# Altium project MR26_GSS.PrjPcb (part 1 of 2)
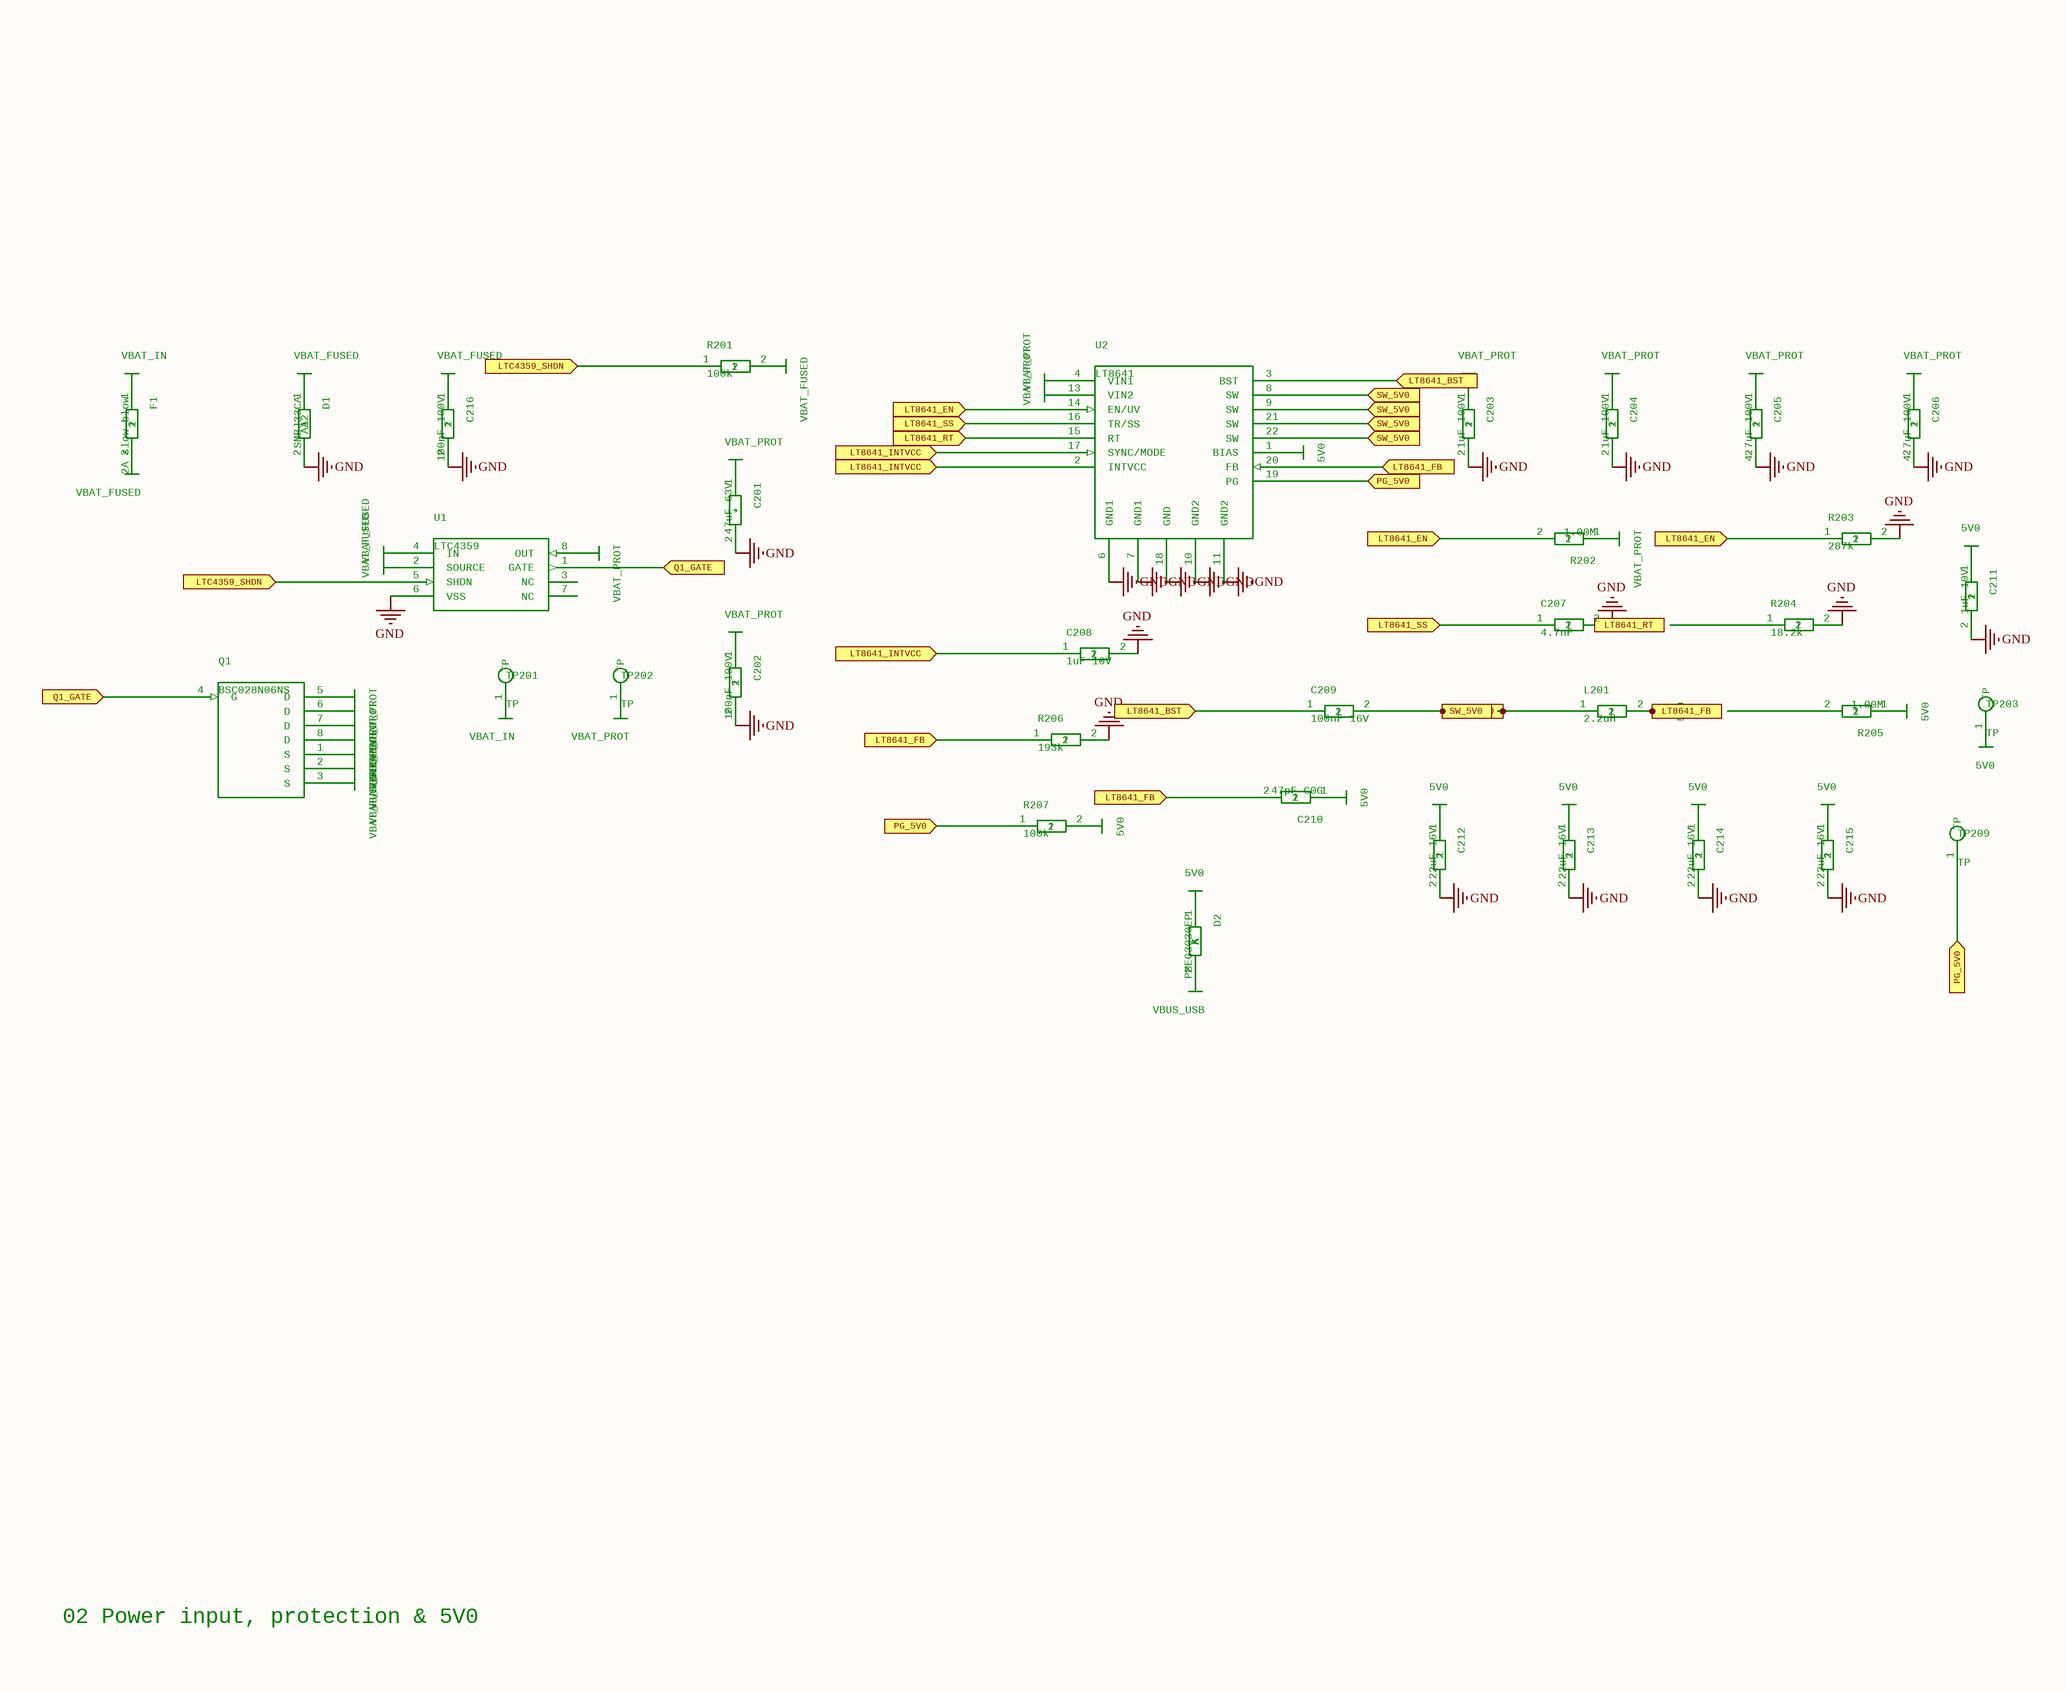
[diagram p0: MR26_GSS_0.SchDoc]
9 sheets, 655 parts. Net scope: global (net labels, ports and power ports of the same name join across sheets).
Board file: MR26_GSS.PcbDoc
Sheets:
  MR26_GSS_0.SchDoc
  MR26_GSS_1.SchDoc
  MR26_GSS_2.SchDoc
  MR26_GSS_3.SchDoc
  MR26_GSS_4.SchDoc
  MR26_GSS_5.SchDoc
  MR26_GSS_6.SchDoc
  MR26_GSS_7.SchDoc
  MR26_GSS_8.SchDoc

## Sheet MR26_GSS_0.SchDoc
size 363 x 297 mm; Origin: Eagle; OriginPath: C:\Users\David Nguyen\Downloads\eagle\eagle\MR26_GSS.sch; OriginSheet: 1; OriginDescription: 02 Power input, protection & 5V0

### Parts
C201  47uF 63V  [C_CP_Elec_8x10]
C202  100nF 100V  [C_0603]
C203  1uF 100V  [C_0805]
C204  1uF 100V  [C_0805]
C205  4.7uF 100V  [C_1210]
C206  4.7uF 100V  [C_1210]
C207  4.7nF  [C_0402]
C208  1uF 10V  [C_0402]
C209  100nF 16V  [C_0402]
C210  47pF C0G  [C_0402]
C211  1uF 10V  [C_0402]
C212  22uF 16V  [C_1210]
C213  22uF 16V  [C_1210]
C214  22uF 16V  [C_1210]
C215  22uF 16V  [C_1210]
C216  100nF 100V  [C_0603]
D1  SMBJ33CA  [D_SMB]
D2  PMEG3030EP  [D_SOD-128]
F1  2A slow-blow  [Fuse_Nano2_452]
L201  2.2uH  [L_XEL4030]
PWR0001  VBAT_IN
PWR0002  VBAT_FUSED
PWR0003  VBAT_FUSED
PWR0005  VBAT_FUSED
PWR0007  VBAT_FUSED
PWR0008  VBAT_FUSED
PWR0010  VBAT_PROT
PWR0011  VBAT_FUSED
PWR0012  VBAT_PROT
PWR0013  VBAT_PROT
PWR0014  VBAT_PROT
PWR0015  VBAT_PROT
PWR0016  VBAT_FUSED
PWR0017  VBAT_FUSED
PWR0018  VBAT_FUSED
PWR0019  VBAT_PROT
PWR0021  VBAT_PROT
PWR0023  VBAT_IN
PWR0024  VBAT_PROT
PWR0025  VBAT_PROT
PWR0026  VBAT_PROT
PWR0027  5V0
PWR0033  VBAT_PROT
PWR0035  VBAT_PROT
PWR0037  VBAT_PROT
PWR0039  VBAT_PROT
PWR0041  VBAT_PROT
PWR0046  5V0
PWR0047  5V0
PWR0049  5V0
PWR0050  5V0
PWR0052  5V0
PWR0054  5V0
PWR0056  5V0
PWR0058  5V0
PWR0060  5V0
PWR0061  5V0
PWR0062  VBUS_USB
PWR0063  5V0
Q1  BSC028N06NS  [PG-TDSON-8]
R201  100k  [R_0402]
R202  1.00M  [R_0402]
R203  287k  [R_0402]
R204  18.2k  [R_0402]
R205  1.00M  [R_0402]
R206  193k  [R_0402]
R207  100k  [R_0402]
TP201  TP  [TP_1.0mm]
TP202  TP  [TP_1.0mm]
TP203  TP  [TP_1.0mm]
TP209  TP  [TP_1.0mm]
U1  LTC4359  [MSOP-8]
U2  LT8641  [QFN-18_3x4_UDC]

### Ports
LT8641_BST (in), LT8641_EN (in), LT8641_FB (in), LT8641_INTVCC (in), LT8641_RT (in), LT8641_SS (in), LTC4359_SHDN (in), PG_5V0 (in), Q1_GATE (in), SW_5V0 (in)

### Nets
GND: C201.2(-) C202.2 C203.2 C204.2 C205.2 C206.2 C207.2 C208.2 C211.2 C212.2 C213.2 C214.2 C215.2 C216.2 D1.2(A2) R203.2 R204.2 R206.2 U1.6(VSS) U2.6(GND1) U2.7(GND1) U2.10(GND2) U2.11(GND2) U2.18(GND)
NetC201_1: C201.1(+) PWR0019.?1(VBAT_PROT)
NetC202_1: C202.1 PWR0021.?1(VBAT_PROT)
NetC203_1: C203.1 PWR0033.?1(VBAT_PROT)
NetC204_1: C204.1 PWR0035.?1(VBAT_PROT)
NetC205_1: C205.1 PWR0037.?1(VBAT_PROT)
NetC206_1: C206.1 PWR0039.?1(VBAT_PROT)
NetC207_1: C207.1 U2.16(TR/SS) ; port LT8641_SS
NetC208_1: C208.1 U2.2(INTVCC) U2.17(SYNC/MODE) ; port LT8641_INTVCC
NetC209_1: C209.1 U2.3(BST) ; port LT8641_BST
NetC209_2: C209.2 L201.1 U2.8(SW) U2.9(SW) U2.21(SW) U2.22(SW) ; port SW_5V0
NetC210_1: C210.1 PWR0049.?1(5V0)
NetC210_2: C210.2 L201.2 PWR0046.?1(5V0) R206.1 U2.20(FB) ; port LT8641_FB
NetC211_1: C211.1 PWR0050.?1(5V0)
NetC212_1: C212.1 PWR0052.?1(5V0)
NetC213_1: C213.1 PWR0054.?1(5V0)
NetC214_1: C214.1 PWR0056.?1(5V0)
NetC215_1: C215.1 PWR0058.?1(5V0)
NetC216_1: C216.1 PWR0005.?1(VBAT_FUSED)
NetD1_1: D1.1(A1) PWR0003.?1(VBAT_FUSED)
NetD2_1: D2.1(K) PWR0061.?1(5V0)
NetD2_2: D2.2(A) PWR0062.?1(VBUS_USB)
NetF1_1: F1.1 PWR0001.?1(VBAT_IN)
NetF1_2: F1.2 PWR0002.?1(VBAT_FUSED)
NetPWR0007_?1: PWR0007.?1(VBAT_FUSED) U1.4(IN)
NetPWR0008_?1: PWR0008.?1(VBAT_FUSED) U1.2(SOURCE)
NetPWR0010_?1: PWR0010.?1(VBAT_PROT) U1.8(OUT)
NetPWR0011_?1: PWR0011.?1(VBAT_FUSED) R201.2
NetPWR0012_?1: PWR0012.?1(VBAT_PROT) Q1.5(D)
NetPWR0013_?1: PWR0013.?1(VBAT_PROT) Q1.6(D)
NetPWR0014_?1: PWR0014.?1(VBAT_PROT) Q1.7(D)
NetPWR0015_?1: PWR0015.?1(VBAT_PROT) Q1.8(D)
NetPWR0016_?1: PWR0016.?1(VBAT_FUSED) Q1.1(S)
NetPWR0017_?1: PWR0017.?1(VBAT_FUSED) Q1.2(S)
NetPWR0018_?1: PWR0018.?1(VBAT_FUSED) Q1.3(S)
NetPWR0023_?1: PWR0023.?1(VBAT_IN) TP201.1(TP)
NetPWR0024_?1: PWR0024.?1(VBAT_PROT) TP202.1(TP)
NetPWR0025_?1: PWR0025.?1(VBAT_PROT) U2.4(VIN1)
NetPWR0026_?1: PWR0026.?1(VBAT_PROT) U2.13(VIN2)
NetPWR0027_?1: PWR0027.?1(5V0) U2.1(BIAS)
NetPWR0041_?1: PWR0041.?1(VBAT_PROT) R202.1
NetPWR0047_?1: PWR0047.?1(5V0) R205.1
NetPWR0060_?1: PWR0060.?1(5V0) R207.2
NetPWR0063_?1: PWR0063.?1(5V0) TP203.1(TP)
NetQ1_4: Q1.4(G) U1.1(GATE) ; port Q1_GATE
NetR201_1: R201.1 U1.5(SHDN) ; port LTC4359_SHDN
NetR202_2: R202.2 R203.1 U2.14(EN/UV) ; port LT8641_EN
NetR207_1: R207.1 TP209.1(TP) U2.19(PG) ; port PG_5V0
NetU2_15: U2.15(RT) ; port LT8641_RT

Not connected (* = marked no-connect by the designer): R204 1; R205 2; U1 3(NC) 7(NC)

### Notes on the sheet
- 02 Power input, protection & 5V0

### Library data of the parts
C201 = CAP_POLC_CP_Elec_8x10: MPN: Panasonic EEH-ZC1J470P; GateName_1: G$1; SymbolName_1: CAP_POL; DeviceName: C_CP_Elec_8x10; LibraryName: MR26; DeviceSetName: CAP_POL
C202 C216 = CAPC_0603: MPN: CAP 100nF 100V 0603; GateName_1: G$1; SymbolName_1: CAP; DeviceName: C_0603; LibraryName: MR26; DeviceSetName: CAP
C203 C204 = CAPC_0805: MPN: CAP 1uF 100V 0805; GateName_1: G$1; SymbolName_1: CAP; DeviceName: C_0805; LibraryName: MR26; DeviceSetName: CAP
C205 C206 = CAPC_1210: MPN: CAP 4.7uF 100V 1210; GateName_1: G$1; SymbolName_1: CAP; DeviceName: C_1210; LibraryName: MR26; DeviceSetName: CAP
C207 = CAPC_0402: MPN: CAP 4.7nF 0402; GateName_1: G$1; SymbolName_1: CAP; DeviceName: C_0402; LibraryName: MR26; DeviceSetName: CAP
C208 C211 = CAPC_0402: MPN: CAP 1uF 10V 0402; GateName_1: G$1; SymbolName_1: CAP; DeviceName: C_0402; LibraryName: MR26; DeviceSetName: CAP
C209 = CAPC_0402: MPN: CAP 100nF 16V 0402; GateName_1: G$1; SymbolName_1: CAP; DeviceName: C_0402; LibraryName: MR26; DeviceSetName: CAP
C210 = CAPC_0402: MPN: CAP 47pF C0G 0402; GateName_1: G$1; SymbolName_1: CAP; DeviceName: C_0402; LibraryName: MR26; DeviceSetName: CAP
C212-C215 = CAPC_1210: MPN: CAP 22uF 16V 1210; GateName_1: G$1; SymbolName_1: CAP; DeviceName: C_1210; LibraryName: MR26; DeviceSetName: CAP
D1 = TVS_BIDIRD_SMB: GateName_1: G$1; SymbolName_1: TVS_BIDIR; DeviceName: D_SMB; LibraryName: MR26; DeviceSetName: TVS_BIDIR; MPN: SMBJ33CA
D2 = DIODE_SCHOTTKYD_SOD-128: GateName_1: G$1; SymbolName_1: DIODE_SCHOTTKY; DeviceName: D_SOD-128; LibraryName: MR26; DeviceSetName: DIODE_SCHOTTKY; MPN: PMEG3030EP
F1 = FUSEFuse_Nano2_452: MPN: Littelfuse 0452002.MRL; GateName_1: G$1; SymbolName_1: FUSE; DeviceName: Fuse_Nano2_452; LibraryName: MR26; DeviceSetName: FUSE
L201 = INDL_XEL4030: MPN: Coilcraft XEL4030-222MEC; GateName_1: G$1; SymbolName_1: IND; DeviceName: L_XEL4030; LibraryName: MR26; DeviceSetName: IND
PWR0001 PWR0023 = PWR_VBAT_IN: GateName_1: G$1; SymbolName_1: PWR_VBAT_IN; LibraryName: MR26; DeviceSetName: PWR_VBAT_IN
PWR0002 PWR0003 PWR0005 PWR0007 PWR0008 PWR0011 PWR0016 PWR0017 PWR0018 = PWR_VBAT_FUSED: GateName_1: G$1; SymbolName_1: PWR_VBAT_FUSED; LibraryName: MR26; DeviceSetName: PWR_VBAT_FUSED
PWR0010 PWR0012 PWR0013 PWR0014 PWR0015 PWR0019 PWR0021 PWR0024 PWR0025 PWR0026 PWR0033 PWR0035 PWR0037 PWR0039 PWR0041 = PWR_VBAT_PROT: GateName_1: G$1; SymbolName_1: PWR_VBAT_PROT; LibraryName: MR26; DeviceSetName: PWR_VBAT_PROT
PWR0027 PWR0046 PWR0047 PWR0049 PWR0050 PWR0052 PWR0054 PWR0056 PWR0058 PWR0060 PWR0061 PWR0063 = PWR_5V0: GateName_1: G$1; SymbolName_1: PWR_5V0; LibraryName: MR26; DeviceSetName: PWR_5V0
PWR0062 = PWR_VBUS_USB: GateName_1: G$1; SymbolName_1: PWR_VBUS_USB; LibraryName: MR26; DeviceSetName: PWR_VBUS_USB
Q1 = NMOS_SUPERSO8PG-TDSON-8: GateName_1: G$1; SymbolName_1: NMOS_SUPERSO8; DeviceName: PG-TDSON-8; LibraryName: MR26; DeviceSetName: NMOS_SUPERSO8; MPN: BSC028N06NS
R201 R207 = RESR_0402: MPN: RES 100k 0402; GateName_1: G$1; SymbolName_1: RES; DeviceName: R_0402; LibraryName: MR26; DeviceSetName: RES
R202 R205 = RESR_0402: MPN: RES 1.00M 0402; GateName_1: G$1; SymbolName_1: RES; DeviceName: R_0402; LibraryName: MR26; DeviceSetName: RES
R203 = RESR_0402: MPN: RES 287k 0402; GateName_1: G$1; SymbolName_1: RES; DeviceName: R_0402; LibraryName: MR26; DeviceSetName: RES
R204 = RESR_0402: MPN: RES 18.2k 0402; GateName_1: G$1; SymbolName_1: RES; DeviceName: R_0402; LibraryName: MR26; DeviceSetName: RES
R206 = RESR_0402: MPN: RES 193k 0402; GateName_1: G$1; SymbolName_1: RES; DeviceName: R_0402; LibraryName: MR26; DeviceSetName: RES
TP201-TP203 TP209 = TESTPOINTTP_1.0mm: MPN: Keystone 5019 / 1.0 mm pad; GateName_1: G$1; SymbolName_1: TESTPOINT; DeviceName: TP_1.0mm; LibraryName: MR26; DeviceSetName: TESTPOINT
U1 = LTC4359_MS8MSOP-8: MPN: LTC4359HMS8#PBF; GateName_1: G$1; SymbolName_1: LTC4359_MS8; DeviceName: MSOP-8; LibraryName: MR26; DeviceSetName: LTC4359_MS8
U2 = LT8641_QFN18QFN-18_3x4_UDC: MPN: LT8641EUDC#PBF; GateName_1: G$1; SymbolName_1: LT8641_QFN18; DeviceName: QFN-18_3x4_UDC; LibraryName: MR26; DeviceSetName: LT8641_QFN18

## Sheet MR26_GSS_1.SchDoc
size 337 x 296 mm; Origin: Eagle; OriginPath: C:\Users\David Nguyen\Downloads\eagle\eagle\MR26_GSS.sch; OriginSheet: 2; OriginDescription: 03 Point-of-load regulators 1V1 / 2V5 / 3V3
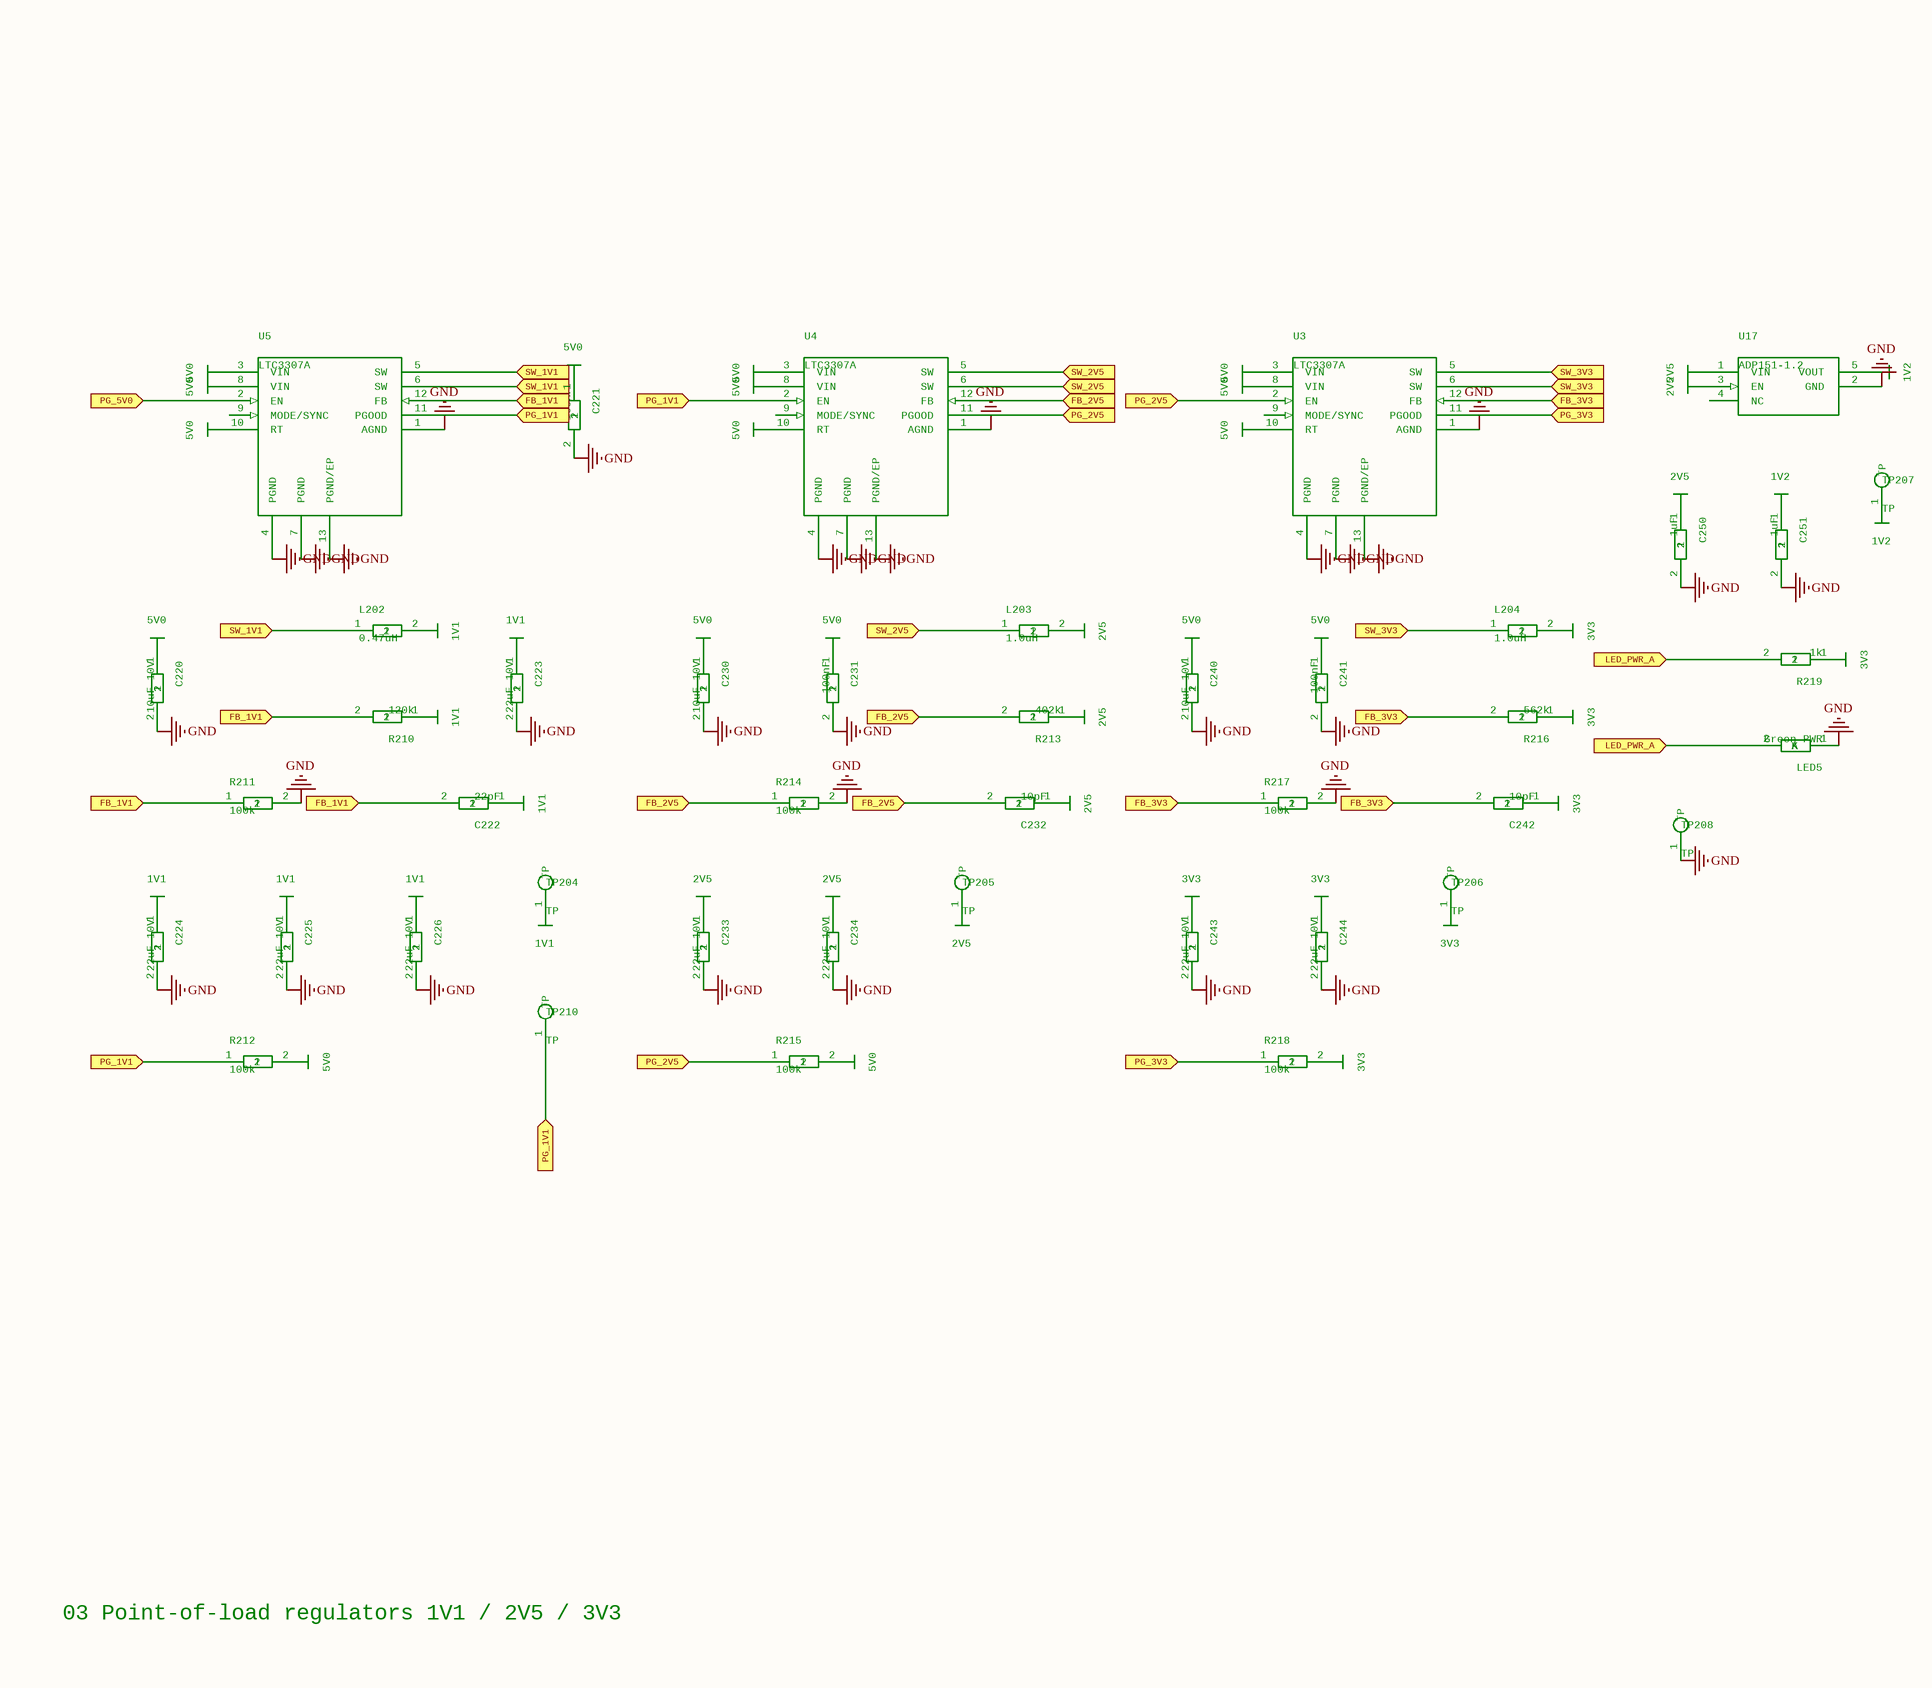
[diagram p1: MR26_GSS_1.SchDoc]

### Parts
C220  10uF 10V  [C_0603]
C221  100nF  [C_0402]
C222  22pF  [C_0402]
C223  22uF 10V  [C_0805]
C224  22uF 10V  [C_0805]
C225  22uF 10V  [C_0805]
C226  22uF 10V  [C_0805]
C230  10uF 10V  [C_0603]
C231  100nF  [C_0402]
C232  10pF  [C_0402]
C233  22uF 10V  [C_0805]
C234  22uF 10V  [C_0805]
C240  10uF 10V  [C_0603]
C241  100nF  [C_0402]
C242  10pF  [C_0402]
C243  22uF 10V  [C_0805]
C244  22uF 10V  [C_0805]
C250  1uF  [C_0402]
C251  1uF  [C_0402]
L202  0.47uH  [L_4x4]
L203  1.0uH  [L_4x4]
L204  1.0uH  [L_4x4]
LED5  Green PWR  [LED_0603]
PWR0064  5V0
PWR0065  5V0
PWR0066  5V0
PWR0071  5V0
PWR0073  5V0
PWR0075  1V1
PWR0076  1V1
PWR0078  1V1
PWR0079  1V1
PWR0081  1V1
PWR0083  1V1
PWR0085  1V1
PWR0087  5V0
PWR0088  1V1
PWR0089  5V0
PWR0090  5V0
PWR0091  5V0
PWR0096  5V0
PWR0098  5V0
PWR0100  2V5
PWR0101  2V5
PWR0103  2V5
PWR0104  2V5
PWR0106  2V5
PWR0108  5V0
PWR0109  2V5
PWR0110  5V0
PWR0111  5V0
PWR0112  5V0
PWR0117  5V0
PWR0119  5V0
PWR0121  3V3
PWR0122  3V3
PWR0124  3V3
PWR0125  3V3
PWR0127  3V3
PWR0129  3V3
PWR0130  3V3
PWR0131  2V5
PWR0132  2V5
PWR0133  1V2
PWR0135  2V5
PWR0137  1V2
PWR0139  1V2
PWR0140  3V3
R210  120k  [R_0402]
R211  100k  [R_0402]
R212  100k  [R_0402]
R213  402k  [R_0402]
R214  100k  [R_0402]
R215  100k  [R_0402]
R216  562k  [R_0402]
R217  100k  [R_0402]
R218  100k  [R_0402]
R219  1k  [R_0402]
TP204  TP  [TP_1.0mm]
TP205  TP  [TP_1.0mm]
TP206  TP  [TP_1.0mm]
TP207  TP  [TP_1.0mm]
TP208  TP  [TP_1.0mm]
TP210  TP  [TP_1.0mm]
U3  LTC3307A  [LQFN-12_2x2]
U4  LTC3307A  [LQFN-12_2x2]
U5  LTC3307A  [LQFN-12_2x2]
U17  ADP151-1.2  [TSOT-23-5]

### Ports
FB_1V1 (in), FB_2V5 (in), FB_3V3 (in), LED_PWR_A (in), PG_1V1 (in), PG_2V5 (in), PG_3V3 (in), PG_5V0 (in), SW_1V1 (in), SW_2V5 (in), SW_3V3 (in)

### Nets
GND: C220.2 C221.2 C223.2 C224.2 C225.2 C226.2 C230.2 C231.2 C233.2 C234.2 C240.2 C241.2 C243.2 C244.2 C250.2 C251.2 LED5.1(K) R211.2 R214.2 R217.2 TP208.1(TP) U3.1(AGND) U3.4(PGND) U3.7(PGND) U3.13(PGND/EP) U4.1(AGND) U4.4(PGND) U4.7(PGND) U4.13(PGND/EP) U5.1(AGND) U5.4(PGND) U5.7(PGND) U5.13(PGND/EP) U17.2(GND)
NetC220_1: C220.1 PWR0071.?1(5V0)
NetC221_1: C221.1 PWR0073.?1(5V0)
NetC222_1: C222.1 PWR0078.?1(1V1)
NetC222_2: C222.2 R210.2 R211.1 U5.12(FB) ; port FB_1V1
NetC223_1: C223.1 PWR0079.?1(1V1)
NetC224_1: C224.1 PWR0081.?1(1V1)
NetC225_1: C225.1 PWR0083.?1(1V1)
NetC226_1: C226.1 PWR0085.?1(1V1)
NetC230_1: C230.1 PWR0096.?1(5V0)
NetC231_1: C231.1 PWR0098.?1(5V0)
NetC232_1: C232.1 PWR0103.?1(2V5)
NetC232_2: C232.2 R213.2 R214.1 U4.12(FB) ; port FB_2V5
NetC233_1: C233.1 PWR0104.?1(2V5)
NetC234_1: C234.1 PWR0106.?1(2V5)
NetC240_1: C240.1 PWR0117.?1(5V0)
NetC241_1: C241.1 PWR0119.?1(5V0)
NetC242_1: C242.1 PWR0124.?1(3V3)
NetC242_2: C242.2 R216.2 R217.1 U3.12(FB) ; port FB_3V3
NetC243_1: C243.1 PWR0125.?1(3V3)
NetC244_1: C244.1 PWR0127.?1(3V3)
NetC250_1: C250.1 PWR0135.?1(2V5)
NetC251_1: C251.1 PWR0137.?1(1V2)
NetL202_1: L202.1 U5.5(SW) U5.6(SW) ; port SW_1V1
NetL202_2: L202.2 PWR0075.?1(1V1)
NetL203_1: L203.1 U4.5(SW) U4.6(SW) ; port SW_2V5
NetL203_2: L203.2 PWR0100.?1(2V5)
NetL204_1: L204.1 U3.5(SW) U3.6(SW) ; port SW_3V3
NetL204_2: L204.2 PWR0121.?1(3V3)
NetLED5_2: LED5.2(A) R219.2 ; port LED_PWR_A
NetPWR0064_?1: PWR0064.?1(5V0) U5.3(VIN)
NetPWR0065_?1: PWR0065.?1(5V0) U5.8(VIN)
NetPWR0066_?1: PWR0066.?1(5V0) U5.10(RT)
NetPWR0076_?1: PWR0076.?1(1V1) R210.1
NetPWR0087_?1: PWR0087.?1(5V0) R212.2
NetPWR0088_?1: PWR0088.?1(1V1) TP204.1(TP)
NetPWR0089_?1: PWR0089.?1(5V0) U4.3(VIN)
NetPWR0090_?1: PWR0090.?1(5V0) U4.8(VIN)
NetPWR0091_?1: PWR0091.?1(5V0) U4.10(RT)
NetPWR0101_?1: PWR0101.?1(2V5) R213.1
NetPWR0108_?1: PWR0108.?1(5V0) R215.2
NetPWR0109_?1: PWR0109.?1(2V5) TP205.1(TP)
NetPWR0110_?1: PWR0110.?1(5V0) U3.3(VIN)
NetPWR0111_?1: PWR0111.?1(5V0) U3.8(VIN)
NetPWR0112_?1: PWR0112.?1(5V0) U3.10(RT)
NetPWR0122_?1: PWR0122.?1(3V3) R216.1
NetPWR0129_?1: PWR0129.?1(3V3) R218.2
NetPWR0130_?1: PWR0130.?1(3V3) TP206.1(TP)
NetPWR0131_?1: PWR0131.?1(2V5) U17.1(VIN)
NetPWR0132_?1: PWR0132.?1(2V5) U17.3(EN)
NetPWR0133_?1: PWR0133.?1(1V2) U17.5(VOUT)
NetPWR0139_?1: PWR0139.?1(1V2) TP207.1(TP)
NetPWR0140_?1: PWR0140.?1(3V3) R219.1
NetR207_1: U5.2(EN) ; port PG_5V0
NetR212_1: R212.1 TP210.1(TP) U4.2(EN) U5.11(PGOOD) ; port PG_1V1
NetR215_1: R215.1 U3.2(EN) U4.11(PGOOD) ; port PG_2V5
NetR218_1: R218.1 U3.11(PGOOD) ; port PG_3V3

Not connected (* = marked no-connect by the designer): U3 9(MODE/SYNC); U4 9(MODE/SYNC); U5 9(MODE/SYNC); U17 4(NC)

### Notes on the sheet
- 03 Point-of-load regulators 1V1 / 2V5 / 3V3

### Library data of the parts
C220 C230 C240 = CAPC_0603: MPN: CAP 10uF 10V 0603; GateName_1: G$1; SymbolName_1: CAP; DeviceName: C_0603; LibraryName: MR26; DeviceSetName: CAP
C221 C231 C241 = CAPC_0402: MPN: CAP 100nF 0402; GateName_1: G$1; SymbolName_1: CAP; DeviceName: C_0402; LibraryName: MR26; DeviceSetName: CAP
C222 = CAPC_0402: MPN: CAP 22pF 0402; GateName_1: G$1; SymbolName_1: CAP; DeviceName: C_0402; LibraryName: MR26; DeviceSetName: CAP
C223-C226 C233 C234 C243 C244 = CAPC_0805: MPN: CAP 22uF 10V 0805; GateName_1: G$1; SymbolName_1: CAP; DeviceName: C_0805; LibraryName: MR26; DeviceSetName: CAP
C232 C242 = CAPC_0402: MPN: CAP 10pF 0402; GateName_1: G$1; SymbolName_1: CAP; DeviceName: C_0402; LibraryName: MR26; DeviceSetName: CAP
C250 C251 = CAPC_0402: MPN: CAP 1uF 0402; GateName_1: G$1; SymbolName_1: CAP; DeviceName: C_0402; LibraryName: MR26; DeviceSetName: CAP
L202 = INDL_4x4: MPN: Coilcraft XFL4015-471MEC; GateName_1: G$1; SymbolName_1: IND; DeviceName: L_4x4; LibraryName: MR26; DeviceSetName: IND
L203 L204 = INDL_4x4: MPN: Coilcraft XFL4020-102MEC; GateName_1: G$1; SymbolName_1: IND; DeviceName: L_4x4; LibraryName: MR26; DeviceSetName: IND
LED5 = LEDLED_0603: MPN: Wurth 150060GS75000; GateName_1: G$1; SymbolName_1: LED; DeviceName: LED_0603; LibraryName: MR26; DeviceSetName: LED
PWR0064 PWR0065 PWR0066 PWR0071 PWR0073 PWR0087 PWR0089 PWR0090 PWR0091 PWR0096 PWR0098 PWR0108 PWR0110 PWR0111 PWR0112 PWR0117 PWR0119 = PWR_5V0: GateName_1: G$1; SymbolName_1: PWR_5V0; LibraryName: MR26; DeviceSetName: PWR_5V0
PWR0075 PWR0076 PWR0078 PWR0079 PWR0081 PWR0083 PWR0085 PWR0088 = PWR_1V1: GateName_1: G$1; SymbolName_1: PWR_1V1; LibraryName: MR26; DeviceSetName: PWR_1V1
PWR0100 PWR0101 PWR0103 PWR0104 PWR0106 PWR0109 PWR0131 PWR0132 PWR0135 = PWR_2V5: GateName_1: G$1; SymbolName_1: PWR_2V5; LibraryName: MR26; DeviceSetName: PWR_2V5
PWR0121 PWR0122 PWR0124 PWR0125 PWR0127 PWR0129 PWR0130 PWR0140 = PWR_3V3: GateName_1: G$1; SymbolName_1: PWR_3V3; LibraryName: MR26; DeviceSetName: PWR_3V3
PWR0133 PWR0137 PWR0139 = PWR_1V2: GateName_1: G$1; SymbolName_1: PWR_1V2; LibraryName: MR26; DeviceSetName: PWR_1V2
R210 = RESR_0402: MPN: RES 120k 0402; GateName_1: G$1; SymbolName_1: RES; DeviceName: R_0402; LibraryName: MR26; DeviceSetName: RES
R211 R212 R214 R215 R217 R218 = RESR_0402: as R201 on sheet MR26_GSS_0; DeviceName: R_0402; LibraryName: MR26; DeviceSetName: RES
R213 = RESR_0402: MPN: RES 402k 0402; GateName_1: G$1; SymbolName_1: RES; DeviceName: R_0402; LibraryName: MR26; DeviceSetName: RES
R216 = RESR_0402: MPN: RES 562k 0402; GateName_1: G$1; SymbolName_1: RES; DeviceName: R_0402; LibraryName: MR26; DeviceSetName: RES
R219 = RESR_0402: MPN: RES 1k 0402; GateName_1: G$1; SymbolName_1: RES; DeviceName: R_0402; LibraryName: MR26; DeviceSetName: RES
TP204-TP208 TP210 = TESTPOINTTP_1.0mm: as TP201 on sheet MR26_GSS_0; SymbolName_1: TESTPOINT; DeviceName: TP_1.0mm; LibraryName: MR26; DeviceSetName: TESTPOINT
U3-U5 = LTC3307A_LQFN12LQFN-12_2x2: MPN: LTC3307AJV#TRMPBF; GateName_1: G$1; SymbolName_1: LTC3307A_LQFN12; DeviceName: LQFN-12_2x2; LibraryName: MR26; DeviceSetName: LTC3307A_LQFN12
U17 = ADP151_TSOT5TSOT-23-5: MPN: ADP151AUJZ-1.2-R7; GateName_1: G$1; SymbolName_1: ADP151_TSOT5; DeviceName: TSOT-23-5; LibraryName: MR26; DeviceSetName: ADP151_TSOT5

## Sheet MR26_GSS_2.SchDoc
size 330 x 296 mm; Origin: Eagle; OriginPath: C:\Users\David Nguyen\Downloads\eagle\eagle\MR26_GSS.sch; OriginSheet: 3; OriginDescription: 04 MCU STM32G474RET6
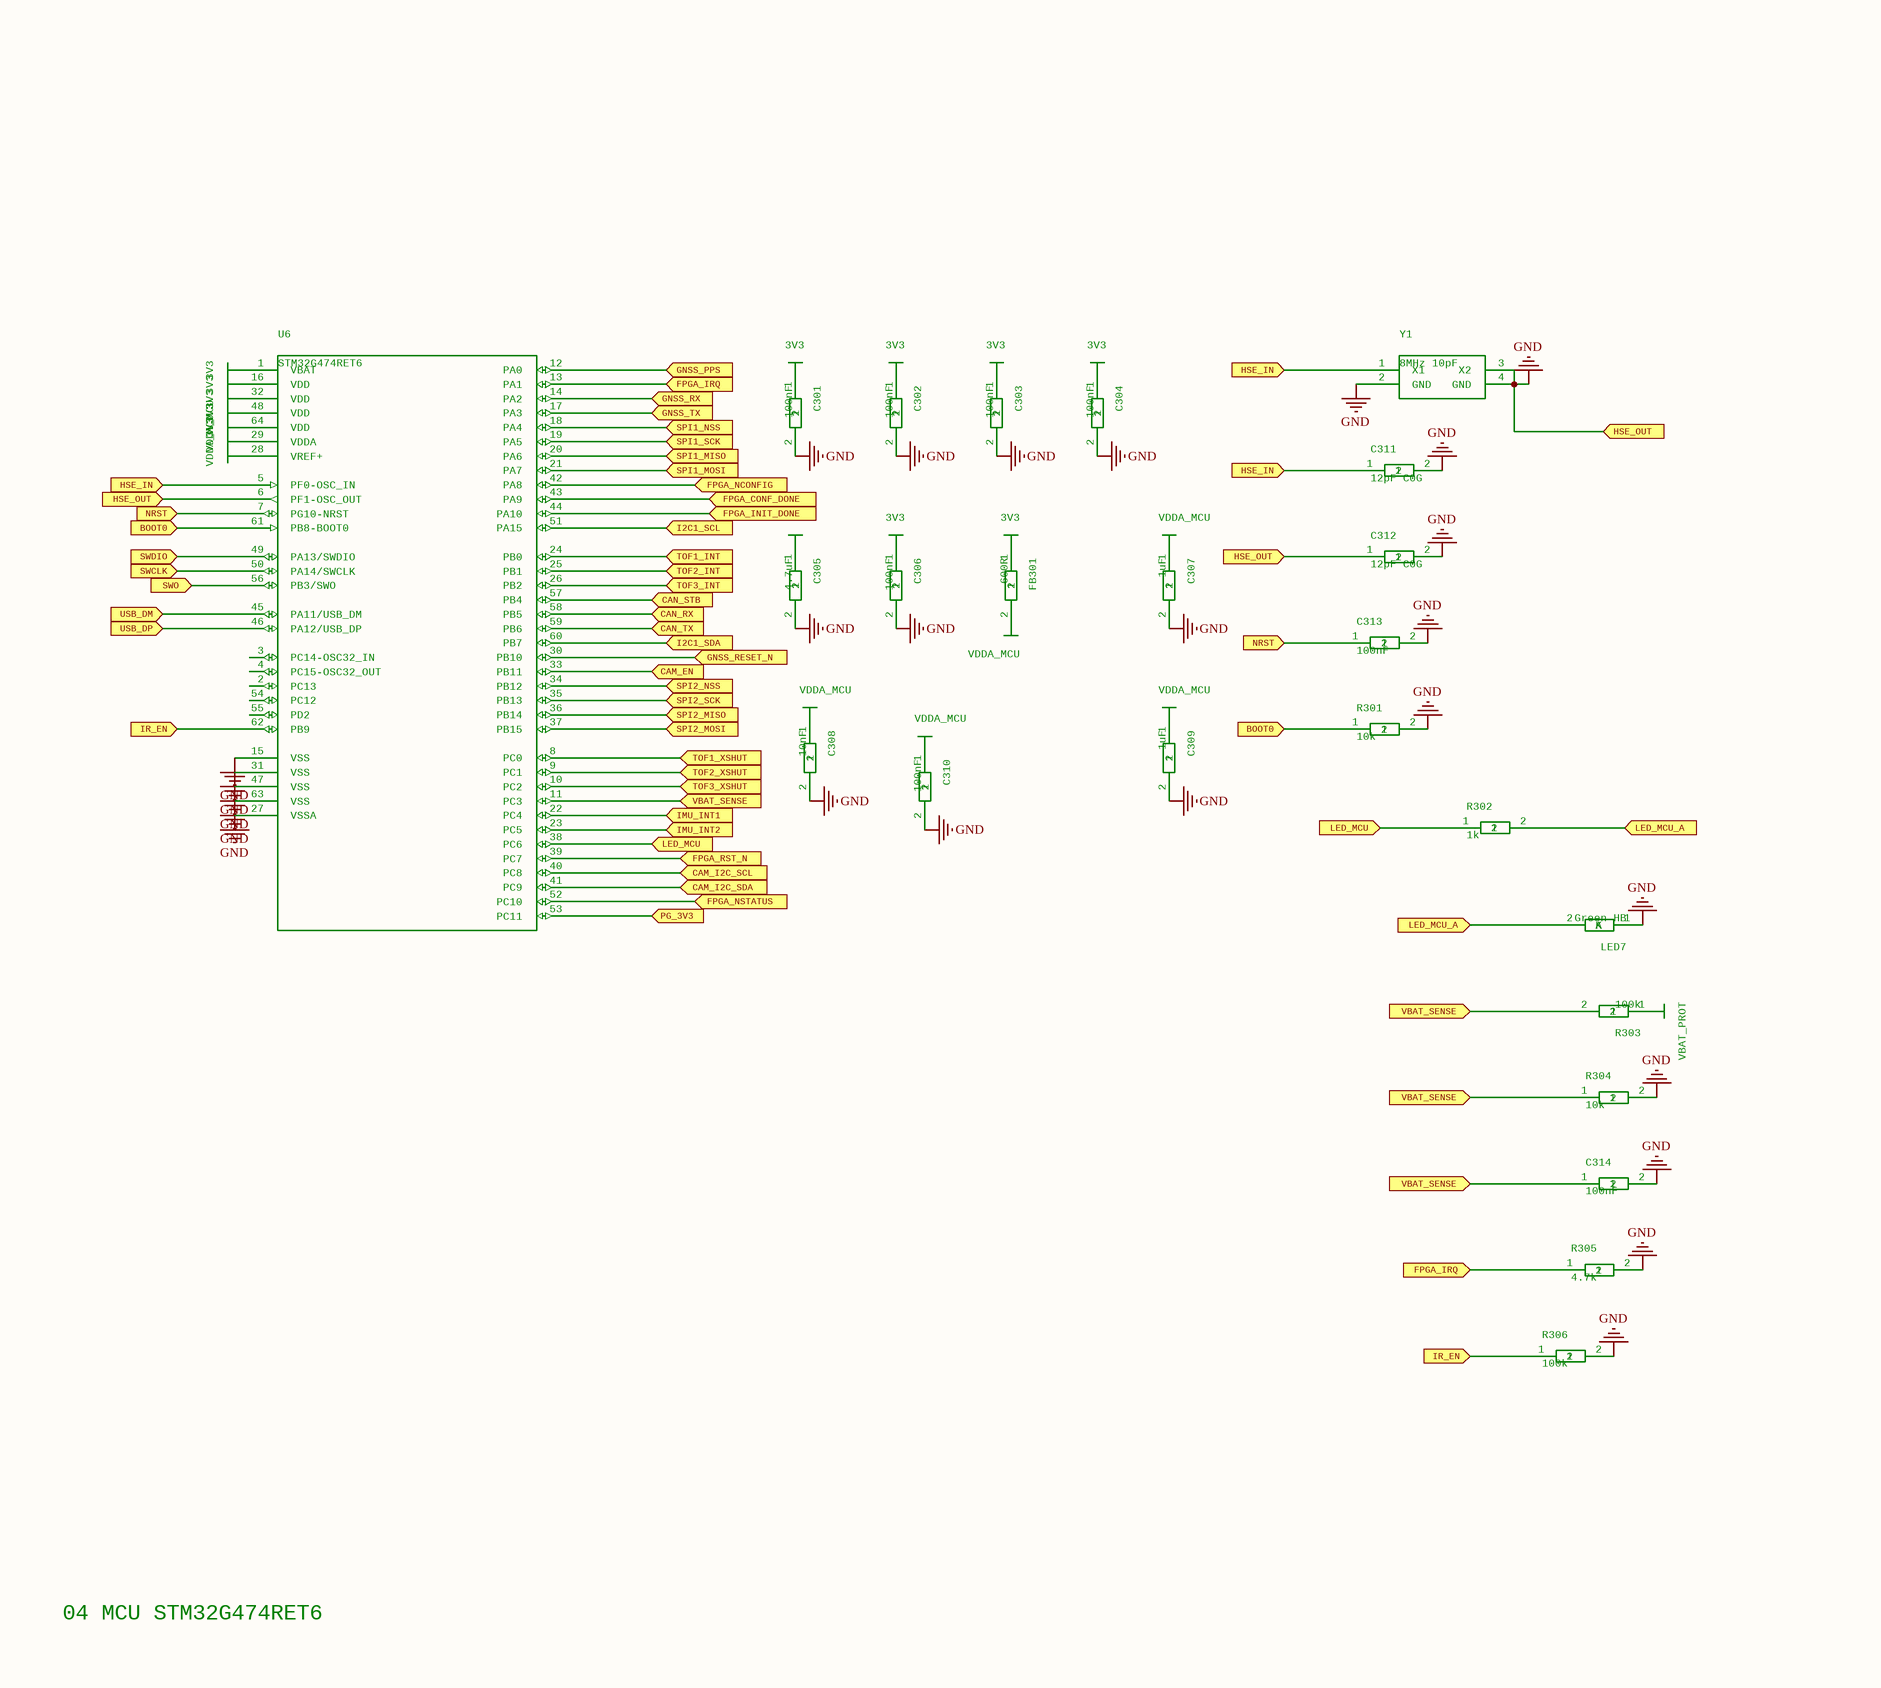
[diagram p2: MR26_GSS_2.SchDoc]

### Parts
C301  100nF  [C_0402]
C302  100nF  [C_0402]
C303  100nF  [C_0402]
C304  100nF  [C_0402]
C305  4.7uF  [C_0603]
C306  100nF  [C_0402]
C307  1uF  [C_0402]
C308  10nF  [C_0402]
C309  1uF  [C_0402]
C310  100nF  [C_0402]
C311  12pF C0G  [C_0402]
C312  12pF C0G  [C_0402]
C313  100nF  [C_0402]
C314  100nF  [C_0402]
FB301  600R  [L_0402]
LED7  Green HB  [LED_0603]
PWR0143  3V3
PWR0144  3V3
PWR0145  3V3
PWR0146  3V3
PWR0147  3V3
PWR0148  VDDA_MCU
PWR0149  VDDA_MCU
PWR0155  3V3
PWR0157  3V3
PWR0159  3V3
PWR0161  3V3
PWR0163  3V3
PWR0165  3V3
PWR0167  3V3
PWR0168  VDDA_MCU
PWR0169  VDDA_MCU
PWR0171  VDDA_MCU
PWR0173  VDDA_MCU
PWR0175  VDDA_MCU
PWR0184  VBAT_PROT
R301  10k  [R_0402]
R302  1k  [R_0402]
R303  100k  [R_0402]
R304  10k  [R_0402]
R305  4.7k  [R_0402]
R306  100k  [R_0402]
U6  STM32G474RET6  [LQFP-64_10x10]
Y1  8MHz 10pF  [Crystal_3225_4pad]

### Ports
BOOT0 (in), CAM_EN (in), CAM_I2C_SCL (in), CAM_I2C_SDA (in), CAN_RX (in), CAN_STB (in), CAN_TX (in), FPGA_CONF_DONE (in), FPGA_INIT_DONE (in), FPGA_IRQ (in), FPGA_NCONFIG (in), FPGA_NSTATUS (in), FPGA_RST_N (in), GNSS_PPS (in), GNSS_RESET_N (in), GNSS_RX (in), GNSS_TX (in), HSE_IN (in), HSE_OUT (in), I2C1_SCL (in), I2C1_SDA (in), IMU_INT1 (in), IMU_INT2 (in), IR_EN (in), LED_MCU (in), LED_MCU_A (in), NRST (in), PG_3V3 (in), SPI1_MISO (in), SPI1_MOSI (in), SPI1_NSS (in), SPI1_SCK (in), SPI2_MISO (in), SPI2_MOSI (in), SPI2_NSS (in), SPI2_SCK (in), SWCLK (in), SWDIO (in), SWO (in), TOF1_INT (in), TOF1_XSHUT (in), TOF2_INT (in), TOF2_XSHUT (in), TOF3_INT (in), TOF3_XSHUT (in), USB_DM (in), USB_DP (in), VBAT_SENSE (in)

### Nets
GND: C301.2 C302.2 C303.2 C304.2 C305.2 C306.2 C307.2 C308.2 C309.2 C310.2 C311.2 C312.1 C312.2 C313.2 C314.2 LED7.1(K) R301.2 R304.2 R305.2 R306.2 U6.6(PF1-OSC_OUT) U6.15(VSS) U6.27(VSSA) U6.31(VSS) U6.47(VSS) U6.63(VSS) Y1.2(GND) Y1.3(X2) Y1.4(GND) ; port HSE_OUT
NetC301_1: C301.1 PWR0155.?1(3V3)
NetC302_1: C302.1 PWR0157.?1(3V3)
NetC303_1: C303.1 PWR0159.?1(3V3)
NetC304_1: C304.1 PWR0161.?1(3V3)
NetC305_1: C305.1 PWR0163.?1(3V3)
NetC306_1: C306.1 PWR0165.?1(3V3)
NetC307_1: C307.1 PWR0169.?1(VDDA_MCU)
NetC308_1: C308.1 PWR0171.?1(VDDA_MCU)
NetC309_1: C309.1 PWR0173.?1(VDDA_MCU)
NetC310_1: C310.1 PWR0175.?1(VDDA_MCU)
NetC311_1: C311.1 U6.5(PF0-OSC_IN) Y1.1(X1) ; port HSE_IN
NetC313_1: C313.1 U6.7(PG10-NRST) ; port NRST
NetC314_1: C314.1 R303.2 R304.1 U6.11(PC3) ; port VBAT_SENSE
NetFB301_1: FB301.1 PWR0167.?1(3V3)
NetFB301_2: FB301.2 PWR0168.?1(VDDA_MCU)
NetJ2_A6: U6.46(PA12/USB_DP) ; port USB_DP
NetJ2_A7: U6.45(PA11/USB_DM) ; port USB_DM
NetJ4_2: U6.49(PA13/SWDIO) ; port SWDIO
NetJ4_4: U6.50(PA14/SWCLK) ; port SWCLK
NetJ4_6: U6.56(PB3/SWO) ; port SWO
NetJ5_17: U6.33(PB11) ; port CAM_EN
NetJ5_20: U6.40(PC8) ; port CAM_I2C_SCL
NetJ5_21: U6.41(PC9) ; port CAM_I2C_SDA
NetLED7_2: LED7.2(A) R302.2 ; port LED_MCU_A
NetPWR0143_?1: PWR0143.?1(3V3) U6.1(VBAT)
NetPWR0144_?1: PWR0144.?1(3V3) U6.16(VDD)
NetPWR0145_?1: PWR0145.?1(3V3) U6.32(VDD)
NetPWR0146_?1: PWR0146.?1(3V3) U6.48(VDD)
NetPWR0147_?1: PWR0147.?1(3V3) U6.64(VDD)
NetPWR0148_?1: PWR0148.?1(VDDA_MCU) U6.29(VDDA)
NetPWR0149_?1: PWR0149.?1(VDDA_MCU) U6.28(VREF+)
NetPWR0184_?1: PWR0184.?1(VBAT_PROT) R303.1
NetQ5_1: U6.43(PA9) ; port FPGA_CONF_DONE
NetR218_1: U6.53(PC11) ; port PG_3V3
NetR301_1: R301.1 U6.61(PB8-BOOT0) ; port BOOT0
NetR302_1: R302.1 U6.38(PC6) ; port LED_MCU
NetR305_1: R305.1 U6.13(PA1) ; port FPGA_IRQ
NetR306_1: R306.1 U6.62(PB9) ; port IR_EN
NetR411_1: U6.42(PA8) ; port FPGA_NCONFIG
NetR412_1: U6.52(PC10) ; port FPGA_NSTATUS
NetR414_1: U6.44(PA10) ; port FPGA_INIT_DONE
NetR601_1: U6.18(PA4) ; port SPI1_NSS
NetR603_1: U6.8(PC0) ; port TOF1_XSHUT
NetR604_1: U6.24(PB0) ; port TOF1_INT
NetR605_1: U6.9(PC1) ; port TOF2_XSHUT
NetR606_1: U6.25(PB1) ; port TOF2_INT
NetR607_1: U6.10(PC2) U6.51(PA15) ; port I2C1_SCL, port TOF3_XSHUT
NetR608_1: U6.26(PB2) ; port TOF3_INT
NetR619_1: U6.60(PB7) ; port I2C1_SDA
NetU6_12: U6.12(PA0) ; port GNSS_PPS
NetU6_14: U6.14(PA2) ; port GNSS_RX
NetU6_17: U6.17(PA3) ; port GNSS_TX
NetU6_19: U6.19(PA5) ; port SPI1_SCK
NetU6_20: U6.20(PA6) ; port SPI1_MISO
NetU6_21: U6.21(PA7) ; port SPI1_MOSI
NetU6_22: U6.22(PC4) ; port IMU_INT1
NetU6_23: U6.23(PC5) ; port IMU_INT2
NetU6_30: U6.30(PB10) ; port GNSS_RESET_N
NetU6_34: U6.34(PB12) ; port SPI2_NSS
NetU6_35: U6.35(PB13) ; port SPI2_SCK
NetU6_36: U6.36(PB14) ; port SPI2_MISO
NetU6_37: U6.37(PB15) ; port SPI2_MOSI
NetU6_39: U6.39(PC7) ; port FPGA_RST_N
NetU6_57: U6.57(PB4) ; port CAN_STB
NetU6_58: U6.58(PB5) ; port CAN_RX
NetU6_59: U6.59(PB6) ; port CAN_TX

Not connected (* = marked no-connect by the designer): U6 2(PC13) 3(PC14-OSC32_IN) 4(PC15-OSC32_OUT) 54(PC12) 55(PD2)

### Notes on the sheet
- 04 MCU STM32G474RET6

### Library data of the parts
C301-C304 C306 C310 C313 C314 = CAPC_0402: as C221 on sheet MR26_GSS_1; DeviceName: C_0402; LibraryName: MR26; DeviceSetName: CAP
C305 = CAPC_0603: MPN: CAP 4.7uF 0603; GateName_1: G$1; SymbolName_1: CAP; DeviceName: C_0603; LibraryName: MR26; DeviceSetName: CAP
C307 C309 = CAPC_0402: as C250 on sheet MR26_GSS_1; DeviceName: C_0402; LibraryName: MR26; DeviceSetName: CAP
C308 = CAPC_0402: MPN: CAP 10nF 0402; GateName_1: G$1; SymbolName_1: CAP; DeviceName: C_0402; LibraryName: MR26; DeviceSetName: CAP
C311 C312 = CAPC_0402: MPN: CAP 12pF C0G 0402; GateName_1: G$1; SymbolName_1: CAP; DeviceName: C_0402; LibraryName: MR26; DeviceSetName: CAP
FB301 = FERRITEL_0402: MPN: Murata BLM15AG601SN1D; GateName_1: G$1; SymbolName_1: FERRITE; DeviceName: L_0402; LibraryName: MR26; DeviceSetName: FERRITE
LED7 = LEDLED_0603: as LED5 on sheet MR26_GSS_1; DeviceName: LED_0603; LibraryName: MR26; DeviceSetName: LED
PWR0143 PWR0144 PWR0145 PWR0146 PWR0147 PWR0155 PWR0157 PWR0159 PWR0161 PWR0163 PWR0165 PWR0167 = PWR_3V3: GateName_1: G$1; SymbolName_1: PWR_3V3; LibraryName: MR26; DeviceSetName: PWR_3V3
PWR0148 PWR0149 PWR0168 PWR0169 PWR0171 PWR0173 PWR0175 = PWR_VDDA_MCU: GateName_1: G$1; SymbolName_1: PWR_VDDA_MCU; LibraryName: MR26; DeviceSetName: PWR_VDDA_MCU
PWR0184 = PWR_VBAT_PROT: GateName_1: G$1; SymbolName_1: PWR_VBAT_PROT; LibraryName: MR26; DeviceSetName: PWR_VBAT_PROT
R301 R304 = RESR_0402: MPN: RES 10k 0402; GateName_1: G$1; SymbolName_1: RES; DeviceName: R_0402; LibraryName: MR26; DeviceSetName: RES
R302 = RESR_0402: as R219 on sheet MR26_GSS_1; DeviceName: R_0402; LibraryName: MR26; DeviceSetName: RES
R303 R306 = RESR_0402: as R201 on sheet MR26_GSS_0; DeviceName: R_0402; LibraryName: MR26; DeviceSetName: RES
R305 = RESR_0402: MPN: RES 4.7k 0402; GateName_1: G$1; SymbolName_1: RES; DeviceName: R_0402; LibraryName: MR26; DeviceSetName: RES
U6 = STM32G474RET6LQFP-64_10x10: GateName_1: G$1; SymbolName_1: STM32G474RET6; DeviceName: LQFP-64_10x10; LibraryName: MR26; DeviceSetName: STM32G474RET6; MPN: STM32G474RET6
Y1 = XTAL_4PADCrystal_3225_4pad: MPN: Abracon ABM8-8.000MHZ-10-D1G-T; GateName_1: G$1; SymbolName_1: XTAL_4PAD; DeviceName: Crystal_3225_4pad; LibraryName: MR26; DeviceSetName: XTAL_4PAD

## Sheet MR26_GSS_3.SchDoc
size 388 x 296 mm; Origin: Eagle; OriginPath: C:\Users\David Nguyen\Downloads\eagle\eagle\MR26_GSS.sch; OriginSheet: 4; OriginDescription: 05 FPGA power & decoupling
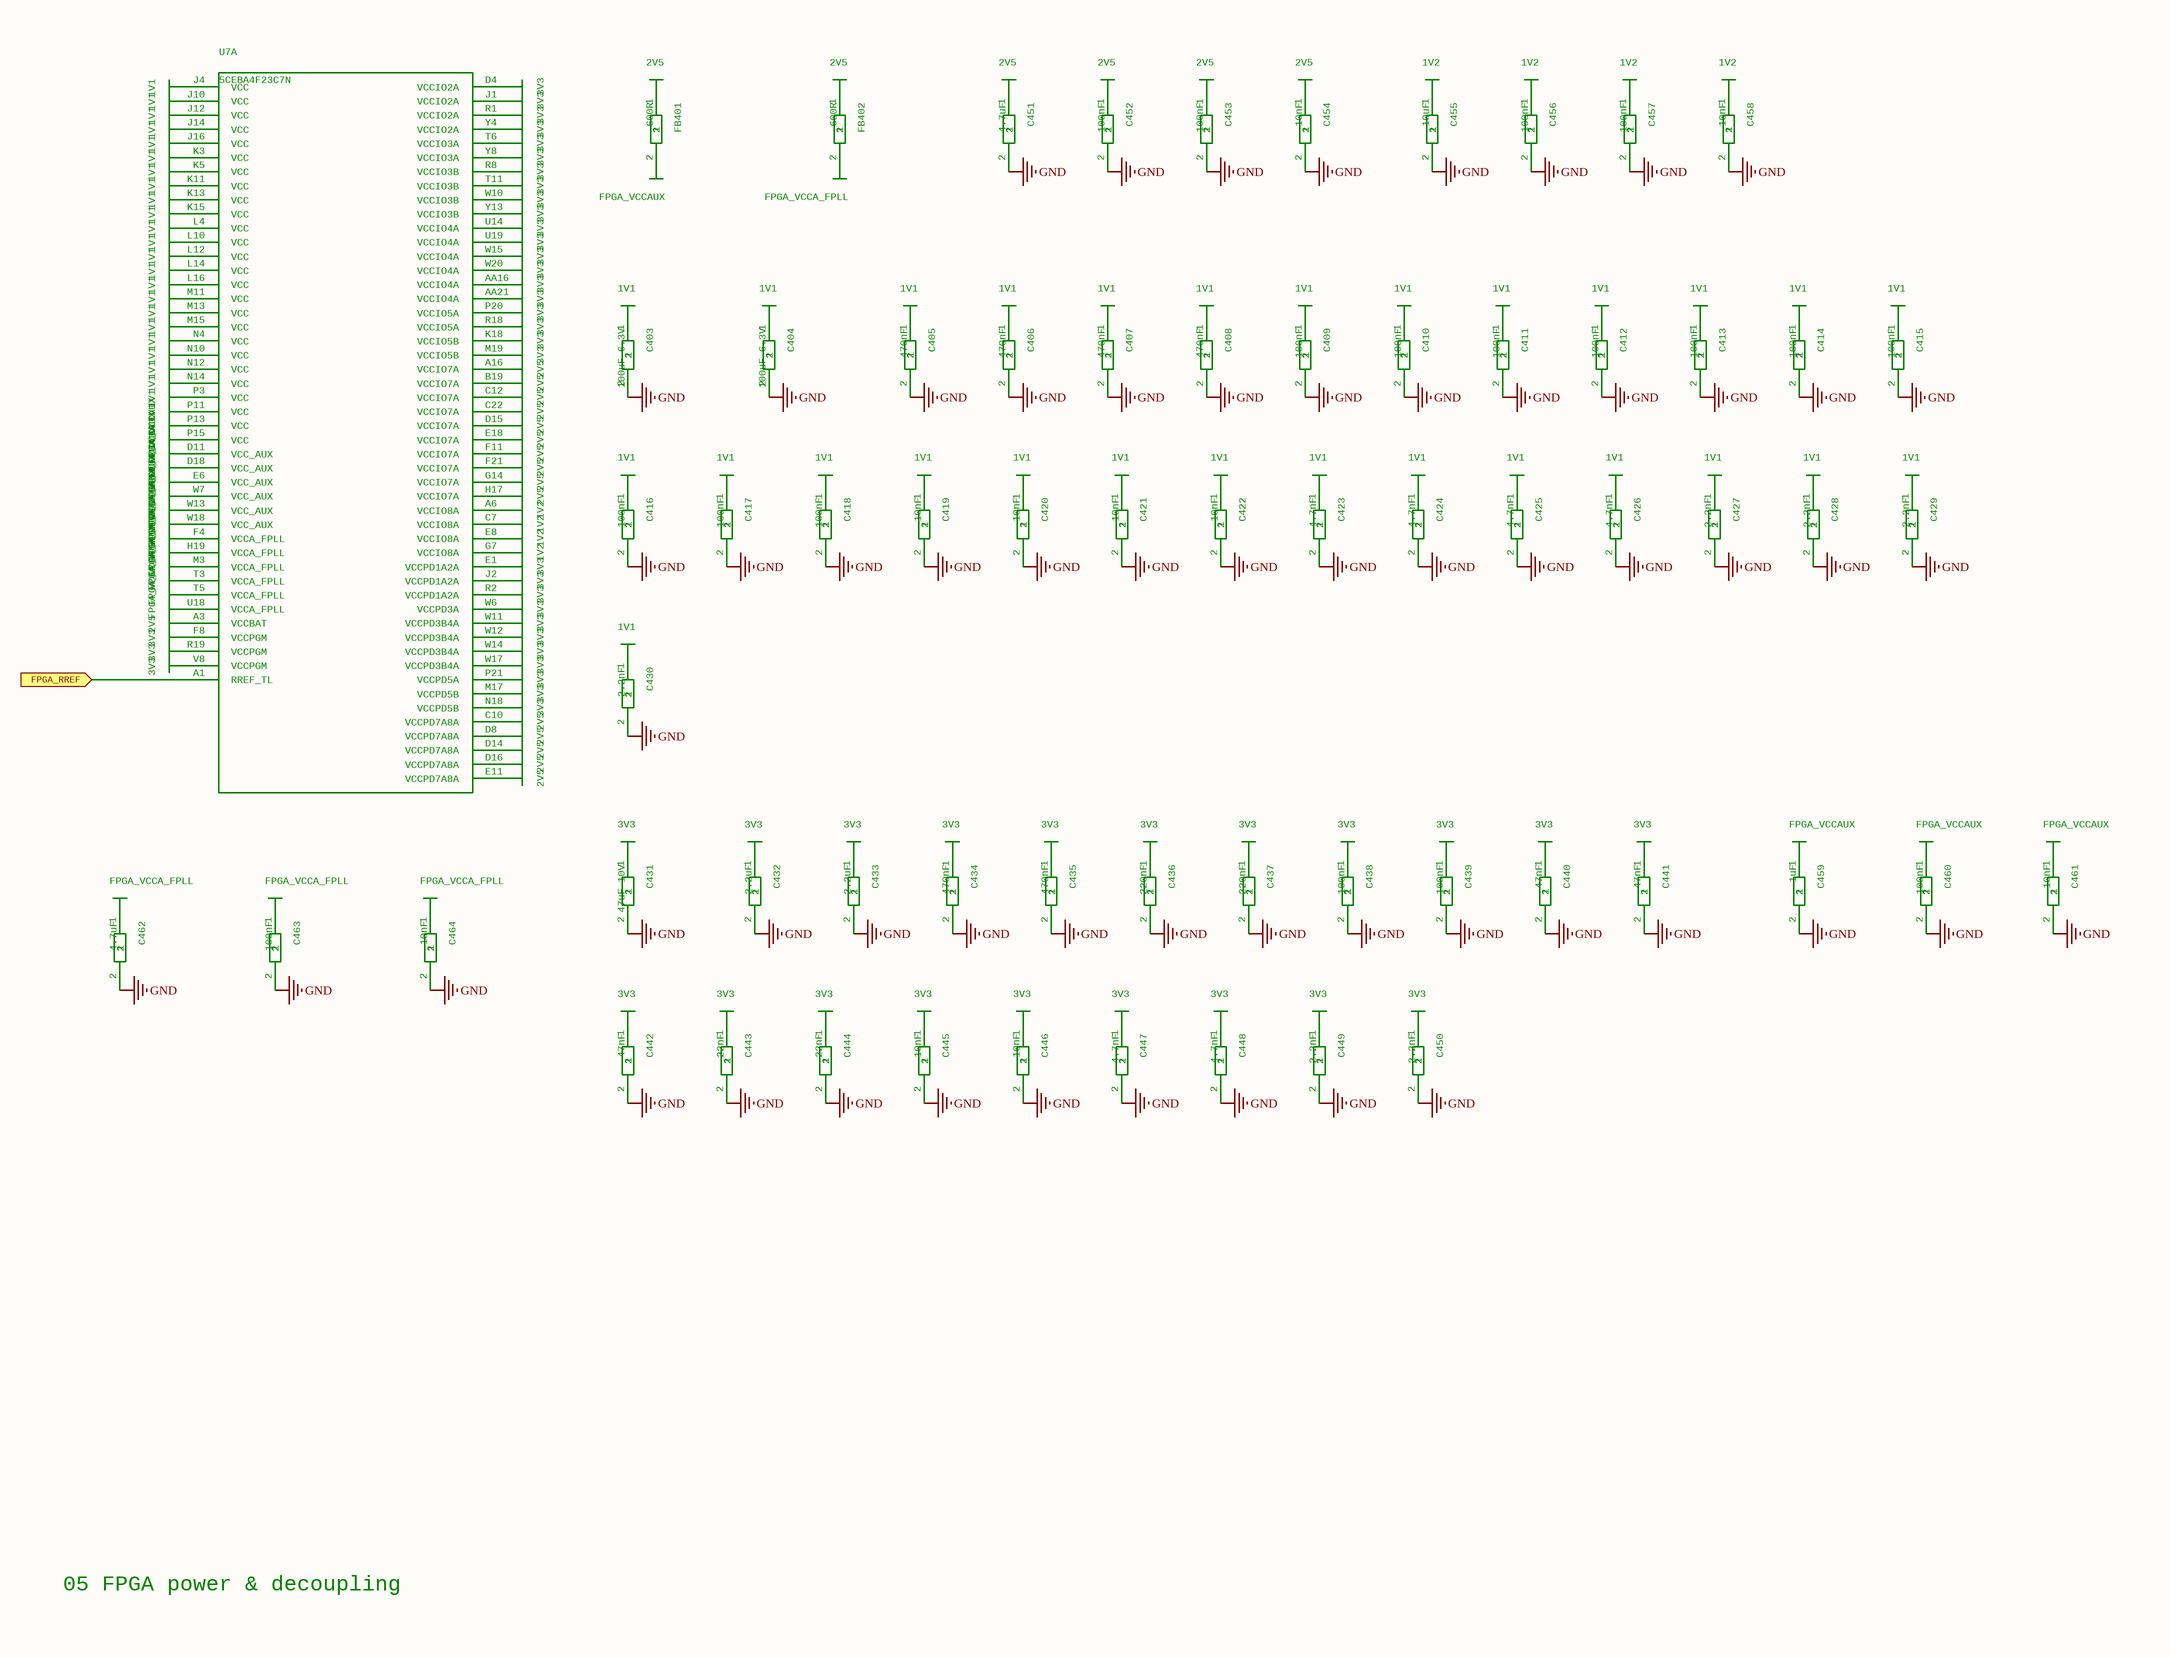
[diagram p3: MR26_GSS_3.SchDoc]

### Parts
C403  100uF 6.3V  [C_1210]
C404  100uF 6.3V  [C_1210]
C405  470nF  [C_0402]
C406  470nF  [C_0402]
C407  470nF  [C_0402]
C408  470nF  [C_0402]
C409  100nF  [C_0402]
C410  100nF  [C_0402]
C411  100nF  [C_0402]
C412  100nF  [C_0402]
C413  100nF  [C_0402]
C414  100nF  [C_0402]
C415  100nF  [C_0402]
C416  100nF  [C_0402]
C417  100nF  [C_0402]
C418  100nF  [C_0402]
C419  10nF  [C_0402]
C420  10nF  [C_0402]
C421  10nF  [C_0402]
C422  10nF  [C_0402]
C423  4.7nF  [C_0402]
C424  4.7nF  [C_0402]
C425  4.7nF  [C_0402]
C426  4.7nF  [C_0402]
C427  2.2nF  [C_0402]
C428  2.2nF  [C_0402]
C429  2.2nF  [C_0402]
C430  2.2nF  [C_0402]
C431  47uF 10V  [C_1210]
C432  2.2uF  [C_0603]
C433  2.2uF  [C_0603]
C434  470nF  [C_0402]
C435  470nF  [C_0402]
C436  220nF  [C_0402]
C437  220nF  [C_0402]
C438  100nF  [C_0402]
C439  100nF  [C_0402]
C440  47nF  [C_0402]
C441  47nF  [C_0402]
C442  47nF  [C_0402]
C443  22nF  [C_0402]
C444  22nF  [C_0402]
C445  10nF  [C_0402]
C446  10nF  [C_0402]
C447  4.7nF  [C_0402]
C448  4.7nF  [C_0402]
C449  2.2nF  [C_0402]
C450  2.2nF  [C_0402]
C451  4.7uF  [C_0603]
C452  100nF  [C_0402]
C453  100nF  [C_0402]
C454  10nF  [C_0402]
C455  10uF  [C_0603]
C456  100nF  [C_0402]
C457  100nF  [C_0402]
C458  10nF  [C_0402]
C459  1uF  [C_0402]
C460  100nF  [C_0402]
C461  10nF  [C_0402]
C462  4.7uF  [C_0603]
C463  100nF  [C_0402]
C464  10nF  [C_0402]
FB401  600R  [L_0603]
FB402  600R  [L_0603]
PWR0189  1V1
PWR0190  1V1
PWR0191  1V1
PWR0192  1V1
PWR0193  1V1
PWR0194  1V1
PWR0195  1V1
PWR0196  1V1
PWR0197  1V1
PWR0198  1V1
PWR0199  1V1
PWR0200  1V1
PWR0201  1V1
PWR0202  1V1
PWR0203  1V1
PWR0204  1V1
PWR0205  1V1
PWR0206  1V1
PWR0207  1V1
PWR0208  1V1
PWR0209  1V1
PWR0210  1V1
PWR0211  1V1
PWR0212  1V1
PWR0213  1V1
PWR0214  1V1
PWR0215  FPGA_VCCAUX
PWR0216  FPGA_VCCAUX
PWR0217  FPGA_VCCAUX
PWR0218  FPGA_VCCAUX
PWR0219  FPGA_VCCAUX
PWR0220  FPGA_VCCAUX
PWR0221  FPGA_VCCA_FPLL
PWR0222  FPGA_VCCA_FPLL
PWR0223  FPGA_VCCA_FPLL
PWR0224  FPGA_VCCA_FPLL
PWR0225  FPGA_VCCA_FPLL
PWR0226  FPGA_VCCA_FPLL
PWR0227  2V5
PWR0228  3V3
PWR0229  3V3
PWR0230  3V3
PWR0231  3V3
PWR0232  3V3
PWR0233  3V3
PWR0234  3V3
PWR0235  3V3
PWR0236  3V3
PWR0237  3V3
PWR0238  3V3
PWR0239  3V3
PWR0240  3V3
PWR0241  3V3
PWR0242  3V3
PWR0243  3V3
PWR0244  3V3
PWR0245  3V3
PWR0246  3V3
PWR0247  3V3
PWR0248  3V3
PWR0249  3V3
PWR0250  3V3
PWR0251  2V5
PWR0252  2V5
PWR0253  2V5
PWR0254  2V5
PWR0255  2V5
PWR0256  2V5
PWR0257  2V5
PWR0258  2V5
PWR0259  2V5
PWR0260  2V5
PWR0261  1V2
PWR0262  1V2
PWR0263  1V2
PWR0264  1V2
PWR0265  3V3
PWR0266  3V3
PWR0267  3V3
PWR0268  3V3
PWR0269  3V3
PWR0270  3V3
PWR0271  3V3
PWR0272  3V3
PWR0273  3V3
PWR0274  3V3
PWR0275  3V3
PWR0276  2V5
PWR0277  2V5
PWR0278  2V5
PWR0279  2V5
PWR0280  2V5
PWR0281  2V5
PWR0282  FPGA_VCCAUX
PWR0283  2V5
PWR0284  FPGA_VCCA_FPLL
PWR0285  1V1
PWR0287  1V1
PWR0289  1V1
PWR0291  1V1
PWR0293  1V1
PWR0295  1V1
PWR0297  1V1
PWR0299  1V1
PWR0301  1V1
PWR0303  1V1
PWR0305  1V1
PWR0307  1V1
PWR0309  1V1
PWR0311  1V1
PWR0313  1V1
PWR0315  1V1
PWR0317  1V1
PWR0319  1V1
PWR0321  1V1
PWR0323  1V1
PWR0325  1V1
PWR0327  1V1
PWR0329  1V1
PWR0331  1V1
PWR0333  1V1
PWR0335  1V1
PWR0337  1V1
PWR0339  1V1
PWR0341  3V3
PWR0343  3V3
PWR0345  3V3
PWR0347  3V3
PWR0349  3V3
PWR0351  3V3
PWR0353  3V3
PWR0355  3V3
PWR0357  3V3
PWR0359  3V3
PWR0361  3V3
PWR0363  3V3
PWR0365  3V3
PWR0367  3V3
PWR0369  3V3
PWR0371  3V3
PWR0373  3V3
PWR0375  3V3
PWR0377  3V3
PWR0379  3V3
PWR0381  2V5
PWR0383  2V5
PWR0385  2V5
PWR0387  2V5
PWR0389  1V2
PWR0391  1V2
PWR0393  1V2
PWR0395  1V2
PWR0397  FPGA_VCCAUX
PWR0399  FPGA_VCCAUX
PWR0401  FPGA_VCCAUX
PWR0403  FPGA_VCCA_FPLL
PWR0405  FPGA_VCCA_FPLL
PWR0407  FPGA_VCCA_FPLL
U7  5CEBA4F23C7N  [FBGA-484_23x23_1.0mm]  (part A of 12)

### Ports
FPGA_RREF (in)

### Nets
GND: C403.2 C404.2 C405.2 C406.2 C407.2 C408.2 C409.2 C410.2 C411.2 C412.2 C413.2 C414.2 C415.2 C416.2 C417.2 C418.2 C419.2 C420.2 C421.2 C422.2 C423.2 C424.2 C425.2 C426.2 C427.2 C428.2 C429.2 C430.2 C431.2 C432.2 C433.2 C434.2 C435.2 C436.2 C437.2 C438.2 C439.2 C440.2 C441.2 C442.2 C443.2 C444.2 C445.2 C446.2 C447.2 C448.2 C449.2 C450.2 C451.2 C452.2 C453.2 C454.2 C455.2 C456.2 C457.2 C458.2 C459.2 C460.2 C461.2 C462.2 C463.2 C464.2
NetC403_1: C403.1 PWR0285.?1(1V1)
NetC404_1: C404.1 PWR0287.?1(1V1)
NetC405_1: C405.1 PWR0289.?1(1V1)
NetC406_1: C406.1 PWR0291.?1(1V1)
NetC407_1: C407.1 PWR0293.?1(1V1)
NetC408_1: C408.1 PWR0295.?1(1V1)
NetC409_1: C409.1 PWR0297.?1(1V1)
NetC410_1: C410.1 PWR0299.?1(1V1)
NetC411_1: C411.1 PWR0301.?1(1V1)
NetC412_1: C412.1 PWR0303.?1(1V1)
NetC413_1: C413.1 PWR0305.?1(1V1)
NetC414_1: C414.1 PWR0307.?1(1V1)
NetC415_1: C415.1 PWR0309.?1(1V1)
NetC416_1: C416.1 PWR0311.?1(1V1)
NetC417_1: C417.1 PWR0313.?1(1V1)
NetC418_1: C418.1 PWR0315.?1(1V1)
NetC419_1: C419.1 PWR0317.?1(1V1)
NetC420_1: C420.1 PWR0319.?1(1V1)
NetC421_1: C421.1 PWR0321.?1(1V1)
NetC422_1: C422.1 PWR0323.?1(1V1)
NetC423_1: C423.1 PWR0325.?1(1V1)
NetC424_1: C424.1 PWR0327.?1(1V1)
NetC425_1: C425.1 PWR0329.?1(1V1)
NetC426_1: C426.1 PWR0331.?1(1V1)
NetC427_1: C427.1 PWR0333.?1(1V1)
NetC428_1: C428.1 PWR0335.?1(1V1)
NetC429_1: C429.1 PWR0337.?1(1V1)
NetC430_1: C430.1 PWR0339.?1(1V1)
NetC431_1: C431.1 PWR0341.?1(3V3)
NetC432_1: C432.1 PWR0343.?1(3V3)
NetC433_1: C433.1 PWR0345.?1(3V3)
NetC434_1: C434.1 PWR0347.?1(3V3)
NetC435_1: C435.1 PWR0349.?1(3V3)
NetC436_1: C436.1 PWR0351.?1(3V3)
NetC437_1: C437.1 PWR0353.?1(3V3)
NetC438_1: C438.1 PWR0355.?1(3V3)
NetC439_1: C439.1 PWR0357.?1(3V3)
NetC440_1: C440.1 PWR0359.?1(3V3)
NetC441_1: C441.1 PWR0361.?1(3V3)
NetC442_1: C442.1 PWR0363.?1(3V3)
NetC443_1: C443.1 PWR0365.?1(3V3)
NetC444_1: C444.1 PWR0367.?1(3V3)
NetC445_1: C445.1 PWR0369.?1(3V3)
NetC446_1: C446.1 PWR0371.?1(3V3)
NetC447_1: C447.1 PWR0373.?1(3V3)
NetC448_1: C448.1 PWR0375.?1(3V3)
NetC449_1: C449.1 PWR0377.?1(3V3)
NetC450_1: C450.1 PWR0379.?1(3V3)
NetC451_1: C451.1 PWR0381.?1(2V5)
NetC452_1: C452.1 PWR0383.?1(2V5)
NetC453_1: C453.1 PWR0385.?1(2V5)
NetC454_1: C454.1 PWR0387.?1(2V5)
NetC455_1: C455.1 PWR0389.?1(1V2)
NetC456_1: C456.1 PWR0391.?1(1V2)
NetC457_1: C457.1 PWR0393.?1(1V2)
NetC458_1: C458.1 PWR0395.?1(1V2)
NetC459_1: C459.1 PWR0397.?1(FPGA_VCCAUX)
NetC460_1: C460.1 PWR0399.?1(FPGA_VCCAUX)
NetC461_1: C461.1 PWR0401.?1(FPGA_VCCAUX)
NetC462_1: C462.1 PWR0403.?1(FPGA_VCCA_FPLL)
NetC463_1: C463.1 PWR0405.?1(FPGA_VCCA_FPLL)
NetC464_1: C464.1 PWR0407.?1(FPGA_VCCA_FPLL)
NetFB401_1: FB401.1 PWR0281.?1(2V5)
NetFB401_2: FB401.2 PWR0282.?1(FPGA_VCCAUX)
NetFB402_1: FB402.1 PWR0283.?1(2V5)
NetFB402_2: FB402.2 PWR0284.?1(FPGA_VCCA_FPLL)
NetPWR0189_?1: PWR0189.?1(1V1) U7.J4(VCC)
NetPWR0190_?1: PWR0190.?1(1V1) U7.J10(VCC)
NetPWR0191_?1: PWR0191.?1(1V1) U7.J12(VCC)
NetPWR0192_?1: PWR0192.?1(1V1) U7.J14(VCC)
NetPWR0193_?1: PWR0193.?1(1V1) U7.J16(VCC)
NetPWR0194_?1: PWR0194.?1(1V1) U7.K3(VCC)
NetPWR0195_?1: PWR0195.?1(1V1) U7.K5(VCC)
NetPWR0196_?1: PWR0196.?1(1V1) U7.K11(VCC)
NetPWR0197_?1: PWR0197.?1(1V1) U7.K13(VCC)
NetPWR0198_?1: PWR0198.?1(1V1) U7.K15(VCC)
NetPWR0199_?1: PWR0199.?1(1V1) U7.L4(VCC)
NetPWR0200_?1: PWR0200.?1(1V1) U7.L10(VCC)
NetPWR0201_?1: PWR0201.?1(1V1) U7.L12(VCC)
NetPWR0202_?1: PWR0202.?1(1V1) U7.L14(VCC)
NetPWR0203_?1: PWR0203.?1(1V1) U7.L16(VCC)
NetPWR0204_?1: PWR0204.?1(1V1) U7.M11(VCC)
NetPWR0205_?1: PWR0205.?1(1V1) U7.M13(VCC)
NetPWR0206_?1: PWR0206.?1(1V1) U7.M15(VCC)
NetPWR0207_?1: PWR0207.?1(1V1) U7.N4(VCC)
NetPWR0208_?1: PWR0208.?1(1V1) U7.N10(VCC)
NetPWR0209_?1: PWR0209.?1(1V1) U7.N12(VCC)
NetPWR0210_?1: PWR0210.?1(1V1) U7.N14(VCC)
NetPWR0211_?1: PWR0211.?1(1V1) U7.P3(VCC)
NetPWR0212_?1: PWR0212.?1(1V1) U7.P11(VCC)
NetPWR0213_?1: PWR0213.?1(1V1) U7.P13(VCC)
NetPWR0214_?1: PWR0214.?1(1V1) U7.P15(VCC)
NetPWR0215_?1: PWR0215.?1(FPGA_VCCAUX) U7.D11(VCC_AUX)
NetPWR0216_?1: PWR0216.?1(FPGA_VCCAUX) U7.D18(VCC_AUX)
NetPWR0217_?1: PWR0217.?1(FPGA_VCCAUX) U7.E6(VCC_AUX)
NetPWR0218_?1: PWR0218.?1(FPGA_VCCAUX) U7.W7(VCC_AUX)
NetPWR0219_?1: PWR0219.?1(FPGA_VCCAUX) U7.W13(VCC_AUX)
NetPWR0220_?1: PWR0220.?1(FPGA_VCCAUX) U7.W18(VCC_AUX)
NetPWR0221_?1: PWR0221.?1(FPGA_VCCA_FPLL) U7.F4(VCCA_FPLL)
NetPWR0222_?1: PWR0222.?1(FPGA_VCCA_FPLL) U7.H19(VCCA_FPLL)
NetPWR0223_?1: PWR0223.?1(FPGA_VCCA_FPLL) U7.M3(VCCA_FPLL)
NetPWR0224_?1: PWR0224.?1(FPGA_VCCA_FPLL) U7.T3(VCCA_FPLL)
NetPWR0225_?1: PWR0225.?1(FPGA_VCCA_FPLL) U7.T5(VCCA_FPLL)
NetPWR0226_?1: PWR0226.?1(FPGA_VCCA_FPLL) U7.U18(VCCA_FPLL)
NetPWR0227_?1: PWR0227.?1(2V5) U7.A3(VCCBAT)
NetPWR0228_?1: PWR0228.?1(3V3) U7.F8(VCCPGM)
NetPWR0229_?1: PWR0229.?1(3V3) U7.R19(VCCPGM)
NetPWR0230_?1: PWR0230.?1(3V3) U7.V8(VCCPGM)
NetPWR0231_?1: PWR0231.?1(3V3) U7.D4(VCCIO2A)
NetPWR0232_?1: PWR0232.?1(3V3) U7.J1(VCCIO2A)
NetPWR0233_?1: PWR0233.?1(3V3) U7.R1(VCCIO2A)
NetPWR0234_?1: PWR0234.?1(3V3) U7.Y4(VCCIO2A)
NetPWR0235_?1: PWR0235.?1(3V3) U7.T6(VCCIO3A)
NetPWR0236_?1: PWR0236.?1(3V3) U7.Y8(VCCIO3A)
NetPWR0237_?1: PWR0237.?1(3V3) U7.R8(VCCIO3B)
NetPWR0238_?1: PWR0238.?1(3V3) U7.T11(VCCIO3B)
NetPWR0239_?1: PWR0239.?1(3V3) U7.W10(VCCIO3B)
NetPWR0240_?1: PWR0240.?1(3V3) U7.Y13(VCCIO3B)
NetPWR0241_?1: PWR0241.?1(3V3) U7.U14(VCCIO4A)
NetPWR0242_?1: PWR0242.?1(3V3) U7.U19(VCCIO4A)
NetPWR0243_?1: PWR0243.?1(3V3) U7.W15(VCCIO4A)
NetPWR0244_?1: PWR0244.?1(3V3) U7.W20(VCCIO4A)
NetPWR0245_?1: PWR0245.?1(3V3) U7.AA16(VCCIO4A)
NetPWR0246_?1: PWR0246.?1(3V3) U7.AA21(VCCIO4A)
NetPWR0247_?1: PWR0247.?1(3V3) U7.P20(VCCIO5A)
NetPWR0248_?1: PWR0248.?1(3V3) U7.R18(VCCIO5A)
NetPWR0249_?1: PWR0249.?1(3V3) U7.K18(VCCIO5B)
NetPWR0250_?1: PWR0250.?1(3V3) U7.M19(VCCIO5B)
NetPWR0251_?1: PWR0251.?1(2V5) U7.A16(VCCIO7A)
NetPWR0252_?1: PWR0252.?1(2V5) U7.B19(VCCIO7A)
NetPWR0253_?1: PWR0253.?1(2V5) U7.C12(VCCIO7A)
NetPWR0254_?1: PWR0254.?1(2V5) U7.C22(VCCIO7A)
NetPWR0255_?1: PWR0255.?1(2V5) U7.D15(VCCIO7A)
NetPWR0256_?1: PWR0256.?1(2V5) U7.E18(VCCIO7A)
NetPWR0257_?1: PWR0257.?1(2V5) U7.F11(VCCIO7A)
NetPWR0258_?1: PWR0258.?1(2V5) U7.F21(VCCIO7A)
NetPWR0259_?1: PWR0259.?1(2V5) U7.G14(VCCIO7A)
NetPWR0260_?1: PWR0260.?1(2V5) U7.H17(VCCIO7A)
NetPWR0261_?1: PWR0261.?1(1V2) U7.A6(VCCIO8A)
NetPWR0262_?1: PWR0262.?1(1V2) U7.C7(VCCIO8A)
NetPWR0263_?1: PWR0263.?1(1V2) U7.E8(VCCIO8A)
NetPWR0264_?1: PWR0264.?1(1V2) U7.G7(VCCIO8A)
NetPWR0265_?1: PWR0265.?1(3V3) U7.E1(VCCPD1A2A)
NetPWR0266_?1: PWR0266.?1(3V3) U7.J2(VCCPD1A2A)
NetPWR0267_?1: PWR0267.?1(3V3) U7.R2(VCCPD1A2A)
NetPWR0268_?1: PWR0268.?1(3V3) U7.W6(VCCPD3A)
NetPWR0269_?1: PWR0269.?1(3V3) U7.W11(VCCPD3B4A)
NetPWR0270_?1: PWR0270.?1(3V3) U7.W12(VCCPD3B4A)
NetPWR0271_?1: PWR0271.?1(3V3) U7.W14(VCCPD3B4A)
NetPWR0272_?1: PWR0272.?1(3V3) U7.W17(VCCPD3B4A)
NetPWR0273_?1: PWR0273.?1(3V3) U7.P21(VCCPD5A)
NetPWR0274_?1: PWR0274.?1(3V3) U7.M17(VCCPD5B)
NetPWR0275_?1: PWR0275.?1(3V3) U7.N18(VCCPD5B)
NetPWR0276_?1: PWR0276.?1(2V5) U7.C10(VCCPD7A8A)
NetPWR0277_?1: PWR0277.?1(2V5) U7.D8(VCCPD7A8A)
NetPWR0278_?1: PWR0278.?1(2V5) U7.D14(VCCPD7A8A)
NetPWR0279_?1: PWR0279.?1(2V5) U7.D16(VCCPD7A8A)
NetPWR0280_?1: PWR0280.?1(2V5) U7.E11(VCCPD7A8A)
NetPWR0428_?1: U7.A1(RREF_TL) ; port FPGA_RREF

### Notes on the sheet
- 05 FPGA power & decoupling

### Library data of the parts
C403 C404 = CAPC_1210: MPN: CAP 100uF 6.3V 1210; GateName_1: G$1; SymbolName_1: CAP; DeviceName: C_1210; LibraryName: MR26; DeviceSetName: CAP
C405-C408 C434 C435 = CAPC_0402: MPN: CAP 470nF 0402; GateName_1: G$1; SymbolName_1: CAP; DeviceName: C_0402; LibraryName: MR26; DeviceSetName: CAP
C409-C418 C438 C439 C452 C453 C456 C457 C460 C463 = CAPC_0402: as C221 on sheet MR26_GSS_1; DeviceName: C_0402; LibraryName: MR26; DeviceSetName: CAP
C419-C422 C445 C446 C454 C458 C461 C464 = CAPC_0402: as C308 on sheet MR26_GSS_2; DeviceName: C_0402; LibraryName: MR26; DeviceSetName: CAP
C423-C426 C447 C448 = CAPC_0402: as C207 on sheet MR26_GSS_0; DeviceName: C_0402; LibraryName: MR26; DeviceSetName: CAP
C427-C430 C449 C450 = CAPC_0402: MPN: CAP 2.2nF 0402; GateName_1: G$1; SymbolName_1: CAP; DeviceName: C_0402; LibraryName: MR26; DeviceSetName: CAP
C431 = CAPC_1210: MPN: CAP 47uF 10V 1210; GateName_1: G$1; SymbolName_1: CAP; DeviceName: C_1210; LibraryName: MR26; DeviceSetName: CAP
C432 C433 = CAPC_0603: MPN: CAP 2.2uF 0603; GateName_1: G$1; SymbolName_1: CAP; DeviceName: C_0603; LibraryName: MR26; DeviceSetName: CAP
C436 C437 = CAPC_0402: MPN: CAP 220nF 0402; GateName_1: G$1; SymbolName_1: CAP; DeviceName: C_0402; LibraryName: MR26; DeviceSetName: CAP
C440-C442 = CAPC_0402: MPN: CAP 47nF 0402; GateName_1: G$1; SymbolName_1: CAP; DeviceName: C_0402; LibraryName: MR26; DeviceSetName: CAP
C443 C444 = CAPC_0402: MPN: CAP 22nF 0402; GateName_1: G$1; SymbolName_1: CAP; DeviceName: C_0402; LibraryName: MR26; DeviceSetName: CAP
C451 C462 = CAPC_0603: as C305 on sheet MR26_GSS_2; DeviceName: C_0603; LibraryName: MR26; DeviceSetName: CAP
C455 = CAPC_0603: MPN: CAP 10uF 0603; GateName_1: G$1; SymbolName_1: CAP; DeviceName: C_0603; LibraryName: MR26; DeviceSetName: CAP
C459 = CAPC_0402: as C250 on sheet MR26_GSS_1; DeviceName: C_0402; LibraryName: MR26; DeviceSetName: CAP
FB401 FB402 = FERRITEL_0603: MPN: Murata BLM18KG601SN1D; GateName_1: G$1; SymbolName_1: FERRITE; DeviceName: L_0603; LibraryName: MR26; DeviceSetName: FERRITE
PWR0189 PWR0190 PWR0191 PWR0192 PWR0193 PWR0194 PWR0195 PWR0196 PWR0197 PWR0198 PWR0199 PWR0200 PWR0201 PWR0202 PWR0203 PWR0204 PWR0205 PWR0206 PWR0207 PWR0208 PWR0209 PWR0210 PWR0211 PWR0212 PWR0213 PWR0214 PWR0285 PWR0287 PWR0289 PWR0291 PWR0293 PWR0295 PWR0297 PWR0299 PWR0301 PWR0303 PWR0305 PWR0307 PWR0309 PWR0311 PWR0313 PWR0315 PWR0317 PWR0319 PWR0321 PWR0323 PWR0325 PWR0327 PWR0329 PWR0331 PWR0333 PWR0335 PWR0337 PWR0339 = PWR_1V1: GateName_1: G$1; SymbolName_1: PWR_1V1; LibraryName: MR26; DeviceSetName: PWR_1V1
PWR0215 PWR0216 PWR0217 PWR0218 PWR0219 PWR0220 PWR0282 PWR0397 PWR0399 PWR0401 = PWR_FPGA_VCCAUX: GateName_1: G$1; SymbolName_1: PWR_FPGA_VCCAUX; LibraryName: MR26; DeviceSetName: PWR_FPGA_VCCAUX
PWR0221 PWR0222 PWR0223 PWR0224 PWR0225 PWR0226 PWR0284 PWR0403 PWR0405 PWR0407 = PWR_FPGA_VCCA_FPLL: GateName_1: G$1; SymbolName_1: PWR_FPGA_VCCA_FPLL; LibraryName: MR26; DeviceSetName: PWR_FPGA_VCCA_FPLL
PWR0227 PWR0251 PWR0252 PWR0253 PWR0254 PWR0255 PWR0256 PWR0257 PWR0258 PWR0259 PWR0260 PWR0276 PWR0277 PWR0278 PWR0279 PWR0280 PWR0281 PWR0283 PWR0381 PWR0383 PWR0385 PWR0387 = PWR_2V5: GateName_1: G$1; SymbolName_1: PWR_2V5; LibraryName: MR26; DeviceSetName: PWR_2V5
PWR0228 PWR0229 PWR0230 PWR0231 PWR0232 PWR0233 PWR0234 PWR0235 PWR0236 PWR0237 PWR0238 PWR0239 PWR0240 PWR0241 PWR0242 PWR0243 PWR0244 PWR0245 PWR0246 PWR0247 PWR0248 PWR0249 PWR0250 PWR0265 PWR0266 PWR0267 PWR0268 PWR0269 PWR0270 PWR0271 PWR0272 PWR0273 PWR0274 PWR0275 PWR0341 PWR0343 PWR0345 PWR0347 PWR0349 PWR0351 PWR0353 PWR0355 PWR0357 PWR0359 PWR0361 PWR0363 PWR0365 PWR0367 PWR0369 PWR0371 PWR0373 PWR0375 PWR0377 PWR0379 = PWR_3V3: GateName_1: G$1; SymbolName_1: PWR_3V3; LibraryName: MR26; DeviceSetName: PWR_3V3
PWR0261 PWR0262 PWR0263 PWR0264 PWR0389 PWR0391 PWR0393 PWR0395 = PWR_1V2: GateName_1: G$1; SymbolName_1: PWR_1V2; LibraryName: MR26; DeviceSetName: PWR_1V2
U7 = 5CEBA4F23C7NFBGA-484_23x23_1.0mm: GateName_1: A; SymbolName_1: 5CEBA4F23C7N_A; GateName_2: B; SymbolName_2: 5CEBA4F23C7N_B; GateName_3: C; SymbolName_3: 5CEBA4F23C7N_C; GateName_4: D; SymbolName_4: 5CEBA4F23C7N_D; GateName_5: E; SymbolName_5: 5CEBA4F23C7N_E; GateName_6: F; SymbolName_6: 5CEBA4F23C7N_F; GateName_7: G; SymbolName_7: 5CEBA4F23C7N_G; GateName_8: H; SymbolName_8: 5CEBA4F23C7N_H; GateName_9: I; SymbolName_9: 5CEBA4F23C7N_I; GateName_10: J; SymbolName_10: 5CEBA4F23C7N_J; GateName_11: K; SymbolName_11: 5CEBA4F23C7N_K; GateName_12: L; SymbolName_12: 5CEBA4F23C7N_L; DeviceName: FBGA-484_23x23_1.0mm; LibraryName: MR26; DeviceSetName: 5CEBA4F23C7N; MPN: 5CEBA4F23C7N

## Sheet MR26_GSS_4.SchDoc
size 325 x 297 mm; Origin: Eagle; OriginPath: C:\Users\David Nguyen\Downloads\eagle\eagle\MR26_GSS.sch; OriginSheet: 5; OriginDescription: 06 FPGA configuration, JTAG & clock
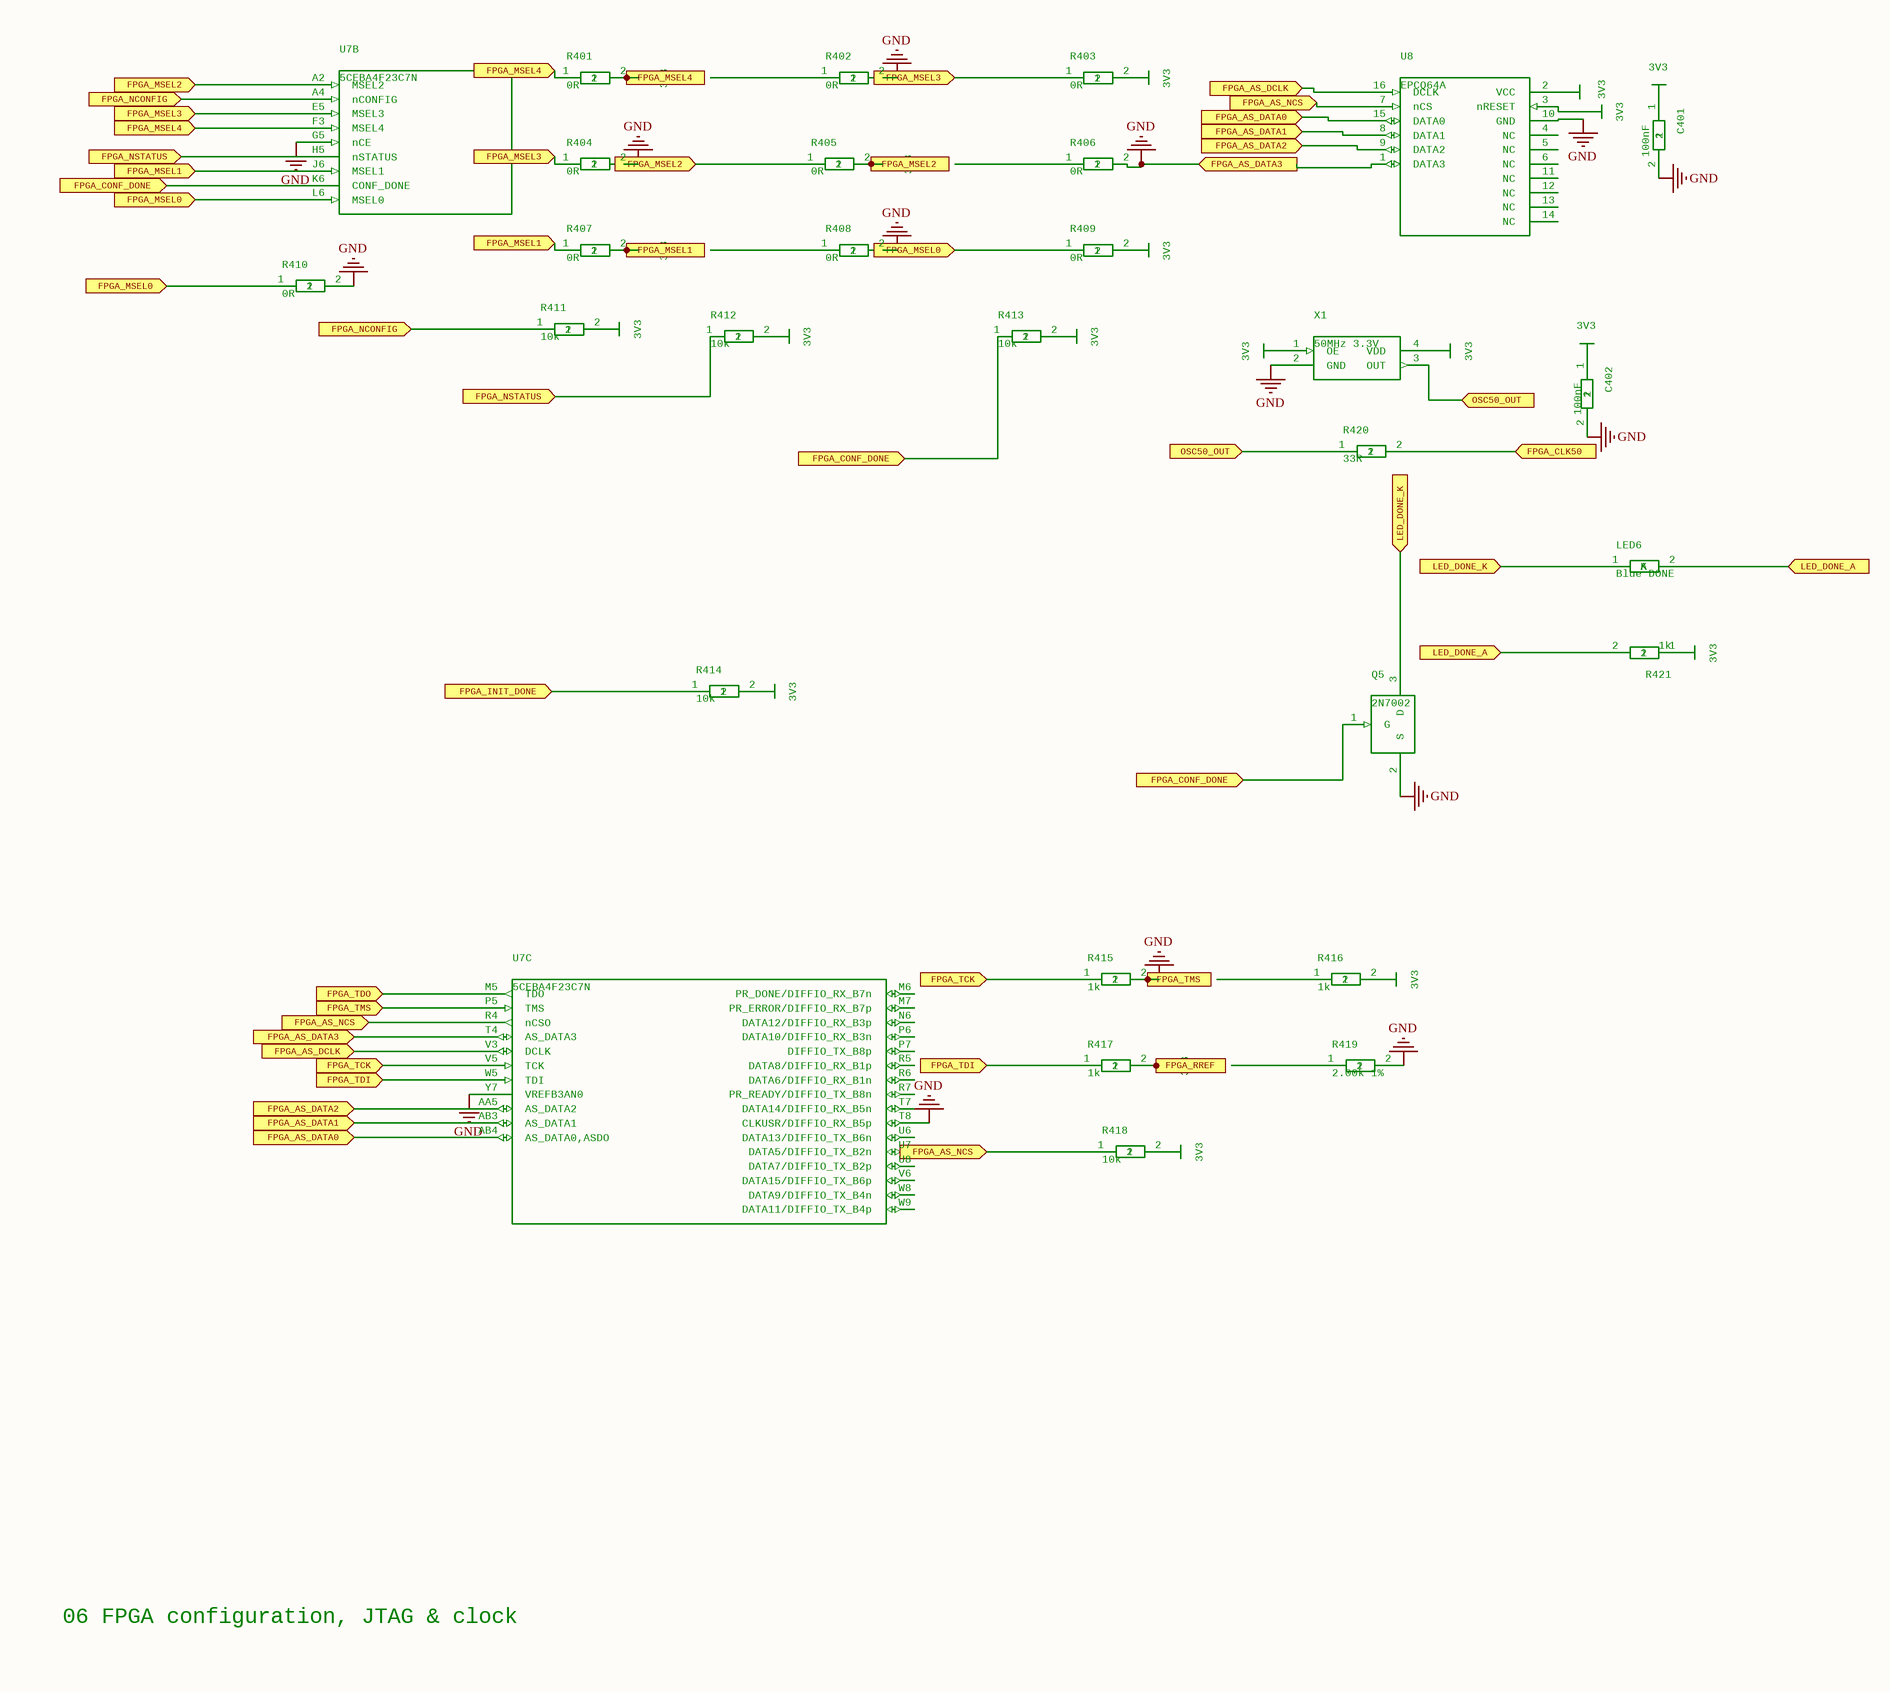
[diagram p4: MR26_GSS_4.SchDoc]

### Parts
C401  100nF  [C_0402]
C402  100nF  [C_0402]
LED6  Blue DONE  [LED_0603]
PWR0410  3V3
PWR0412  3V3
PWR0414  3V3
PWR0416  3V3
PWR0418  3V3
PWR0420  3V3
PWR0421  3V3
PWR0422  3V3
PWR0423  3V3
PWR0427  3V3
PWR0428  3V3
PWR0429  3V3
PWR0431  3V3
PWR0432  3V3
PWR0434  3V3
PWR0436  3V3
PWR0438  3V3
PWR0439  3V3
PWR0442  3V3
Q5  2N7002  [SOT-23]
R401  0R  [R_0402]
R402  0R  [R_0402]
R403  0R  [R_0402]
R404  0R  [R_0402]
R405  0R  [R_0402]
R406  0R  [R_0402]
R407  0R  [R_0402]
R408  0R  [R_0402]
R409  0R  [R_0402]
R410  0R  [R_0402]
R411  10k  [R_0402]
R412  10k  [R_0402]
R413  10k  [R_0402]
R414  10k  [R_0402]
R415  1k  [R_0402]
R416  1k  [R_0402]
R417  1k  [R_0402]
R418  10k  [R_0402]
R419  2.00k 1%  [R_0402]
R420  33R  [R_0402]
R421  1k  [R_0402]
U7  5CEBA4F23C7N  [FBGA-484_23x23_1.0mm]  (parts B,C of 12)
U8  EPCQ64A  [SOIC-16W_7.5x10.3]
X1  50MHz 3.3V  [OSC_2.5x2.0]

### Ports
FPGA_AS_DATA0 (in), FPGA_AS_DATA1 (in), FPGA_AS_DATA2 (in), FPGA_AS_DATA3 (in), FPGA_AS_DCLK (in), FPGA_AS_NCS (in), FPGA_CLK50 (in), FPGA_CONF_DONE (in), FPGA_INIT_DONE (in), FPGA_MSEL0 (in), FPGA_MSEL1 (in), FPGA_MSEL2 (in), FPGA_MSEL3 (in), FPGA_MSEL4 (in), FPGA_NCONFIG (in), FPGA_NSTATUS (in), FPGA_RREF (in), FPGA_TCK (in), FPGA_TDI (in), FPGA_TDO (in), FPGA_TMS (in), LED_DONE_A (in), LED_DONE_K (in), OSC50_OUT (in)

### Nets
GND: C401.2 C402.2 Q5.2(S) R402.2 R404.2 R406.2 R408.2 R410.2 R415.2 R419.2 U7.G5(nCE) U7.P5(TMS) U7.T4(AS_DATA3) U7.T8(CLKUSR/DIFFIO_RX_B5p) U7.Y7(VREFB3AN0) U8.1(DATA3) U8.10(GND) X1.2(GND) ; port FPGA_TMS, port FPGA_AS_DATA3
NetC401_1: C401.1 PWR0434.?1(3V3)
NetC402_1: C402.1 PWR0439.?1(3V3)
NetJ3_1: R415.1 U7.V5(TCK) ; port FPGA_TCK
NetJ3_3: U7.M5(TDO) ; port FPGA_TDO
NetJ3_9: R417.1 U7.W5(TDI) ; port FPGA_TDI
NetLED6_1: LED6.1(K) Q5.3(D) ; port LED_DONE_K
NetLED6_2: LED6.2(A) R421.2 ; port LED_DONE_A
NetPWR0410_?1: PWR0410.?1(3V3) R401.1 R401.2 U7.F3(MSEL4) ; port FPGA_MSEL4
NetPWR0412_?1: PWR0412.?1(3V3) R403.2
NetPWR0414_?1: PWR0414.?1(3V3) R405.1 R405.2 U7.A2(MSEL2) ; port FPGA_MSEL2
NetPWR0416_?1: PWR0416.?1(3V3) R407.1 R407.2 U7.J6(MSEL1) ; port FPGA_MSEL1
NetPWR0418_?1: PWR0418.?1(3V3) R409.2
NetPWR0420_?1: PWR0420.?1(3V3) R411.2
NetPWR0421_?1: PWR0421.?1(3V3) R412.2
NetPWR0422_?1: PWR0422.?1(3V3) R413.2
NetPWR0423_?1: PWR0423.?1(3V3) R414.2
NetPWR0427_?1: PWR0427.?1(3V3) R416.2
NetPWR0428_?1: PWR0428.?1(3V3) R417.2 ; port FPGA_RREF
NetPWR0429_?1: PWR0429.?1(3V3) R418.2
NetPWR0431_?1: PWR0431.?1(3V3) U8.2(VCC)
NetPWR0432_?1: PWR0432.?1(3V3) U8.3(nRESET)
NetPWR0436_?1: PWR0436.?1(3V3) X1.1(OE)
NetPWR0438_?1: PWR0438.?1(3V3) X1.4(VDD)
NetPWR0442_?1: PWR0442.?1(3V3) R421.1
NetQ5_1: Q5.1(G) R413.1 U7.K6(CONF_DONE) ; port FPGA_CONF_DONE
NetR403_1: R403.1 R404.1 U7.E5(MSEL3) ; port FPGA_MSEL3
NetR409_1: R409.1 R410.1 U7.L6(MSEL0) ; port FPGA_MSEL0
NetR411_1: R411.1 U7.A4(nCONFIG) ; port FPGA_NCONFIG
NetR412_1: R412.1 U7.H5(nSTATUS) ; port FPGA_NSTATUS
NetR414_1: R414.1 ; port FPGA_INIT_DONE
NetR418_1: R418.1 U7.R4(nCSO) U8.7(nCS) ; port FPGA_AS_NCS
NetR420_1: R420.1 X1.3(OUT) ; port OSC50_OUT
NetR420_2: R420.2 ; port FPGA_CLK50
NetU7_AA5: U7.AA5(AS_DATA2) U8.9(DATA2) ; port FPGA_AS_DATA2
NetU7_AB3: U7.AB3(AS_DATA1) U8.8(DATA1) ; port FPGA_AS_DATA1
NetU7_AB4: U7.AB4(AS_DATA0,ASDO) U8.15(DATA0) ; port FPGA_AS_DATA0
NetU7_V3: U7.V3(DCLK) U8.16(DCLK) ; port FPGA_AS_DCLK

Not connected (* = marked no-connect by the designer): R402 1; R406 1; R408 1; R416 1; R419 1; U7 M6(PR_DONE/DIFFIO_RX_B7n) M7(PR_ERROR/DIFFIO_RX_B7p) N6(DATA12/DIFFIO_RX_B3p) P6(DATA10/DIFFIO_RX_B3n) P7(DIFFIO_TX_B8p) R5(DATA8/DIFFIO_RX_B1p) R6(DATA6/DIFFIO_RX_B1n) R7(PR_READY/DIFFIO_TX_B8n) T7(DATA14/DIFFIO_RX_B5n) U6(DATA13/DIFFIO_TX_B6n) U7(DATA5/DIFFIO_TX_B2n) U8(DATA7/DIFFIO_TX_B2p) V6(DATA15/DIFFIO_TX_B6p) W8(DATA9/DIFFIO_TX_B4n) W9(DATA11/DIFFIO_TX_B4p); U8 4(NC) 5(NC) 6(NC) 11(NC) 12(NC) 13(NC) 14(NC)

### Notes on the sheet
- 06 FPGA configuration, JTAG & clock

### Library data of the parts
C401 C402 = CAPC_0402: as C221 on sheet MR26_GSS_1; DeviceName: C_0402; LibraryName: MR26; DeviceSetName: CAP
LED6 = LEDLED_0603: MPN: Wurth 150060BS75000; GateName_1: G$1; SymbolName_1: LED; DeviceName: LED_0603; LibraryName: MR26; DeviceSetName: LED
PWR0410 PWR0412 PWR0414 PWR0416 PWR0418 PWR0420 PWR0421 PWR0422 PWR0423 PWR0427 PWR0428 PWR0429 PWR0431 PWR0432 PWR0434 PWR0436 PWR0438 PWR0439 PWR0442 = PWR_3V3: GateName_1: G$1; SymbolName_1: PWR_3V3; LibraryName: MR26; DeviceSetName: PWR_3V3
Q5 = NMOS_SOT23SOT-23: MPN: 2N7002,215; GateName_1: G$1; SymbolName_1: NMOS_SOT23; DeviceName: SOT-23; LibraryName: MR26; DeviceSetName: NMOS_SOT23
R401-R410 = RESR_0402: MPN: RES 0R 0402; GateName_1: G$1; SymbolName_1: RES; DeviceName: R_0402; LibraryName: MR26; DeviceSetName: RES
R411-R414 R418 = RESR_0402: as R301 on sheet MR26_GSS_2; DeviceName: R_0402; LibraryName: MR26; DeviceSetName: RES
R415-R417 R421 = RESR_0402: as R219 on sheet MR26_GSS_1; DeviceName: R_0402; LibraryName: MR26; DeviceSetName: RES
R419 = RESR_0402: MPN: RES 2.00k 1% 0402; GateName_1: G$1; SymbolName_1: RES; DeviceName: R_0402; LibraryName: MR26; DeviceSetName: RES
R420 = RESR_0402: MPN: RES 33R 0402; GateName_1: G$1; SymbolName_1: RES; DeviceName: R_0402; LibraryName: MR26; DeviceSetName: RES
U7 = 5CEBA4F23C7NFBGA-484_23x23_1.0mm: as U7 on sheet MR26_GSS_3; DeviceName: FBGA-484_23x23_1.0mm; LibraryName: MR26; DeviceSetName: 5CEBA4F23C7N; MPN: 5CEBA4F23C7N
U8 = EPCQ64A_SOIC16SOIC-16W_7.5x10.3: MPN: EPCQ64ASI16N; GateName_1: G$1; SymbolName_1: EPCQ64A_SOIC16; DeviceName: SOIC-16W_7.5x10.3; LibraryName: MR26; DeviceSetName: EPCQ64A_SOIC16
X1 = OSC_4PINOSC_2.5x2.0: MPN: SIT1602BI-23-33E-50.000000; GateName_1: G$1; SymbolName_1: OSC_4PIN; DeviceName: OSC_2.5x2.0; LibraryName: MR26; DeviceSetName: OSC_4PIN